# EAGLE schematic axiom_beta_power_board_v2.23.5cae2732 (EAGLE 7.7.0), part 1 of 2
Assembly variants: Beta, Min

## Sheet 1 of 17
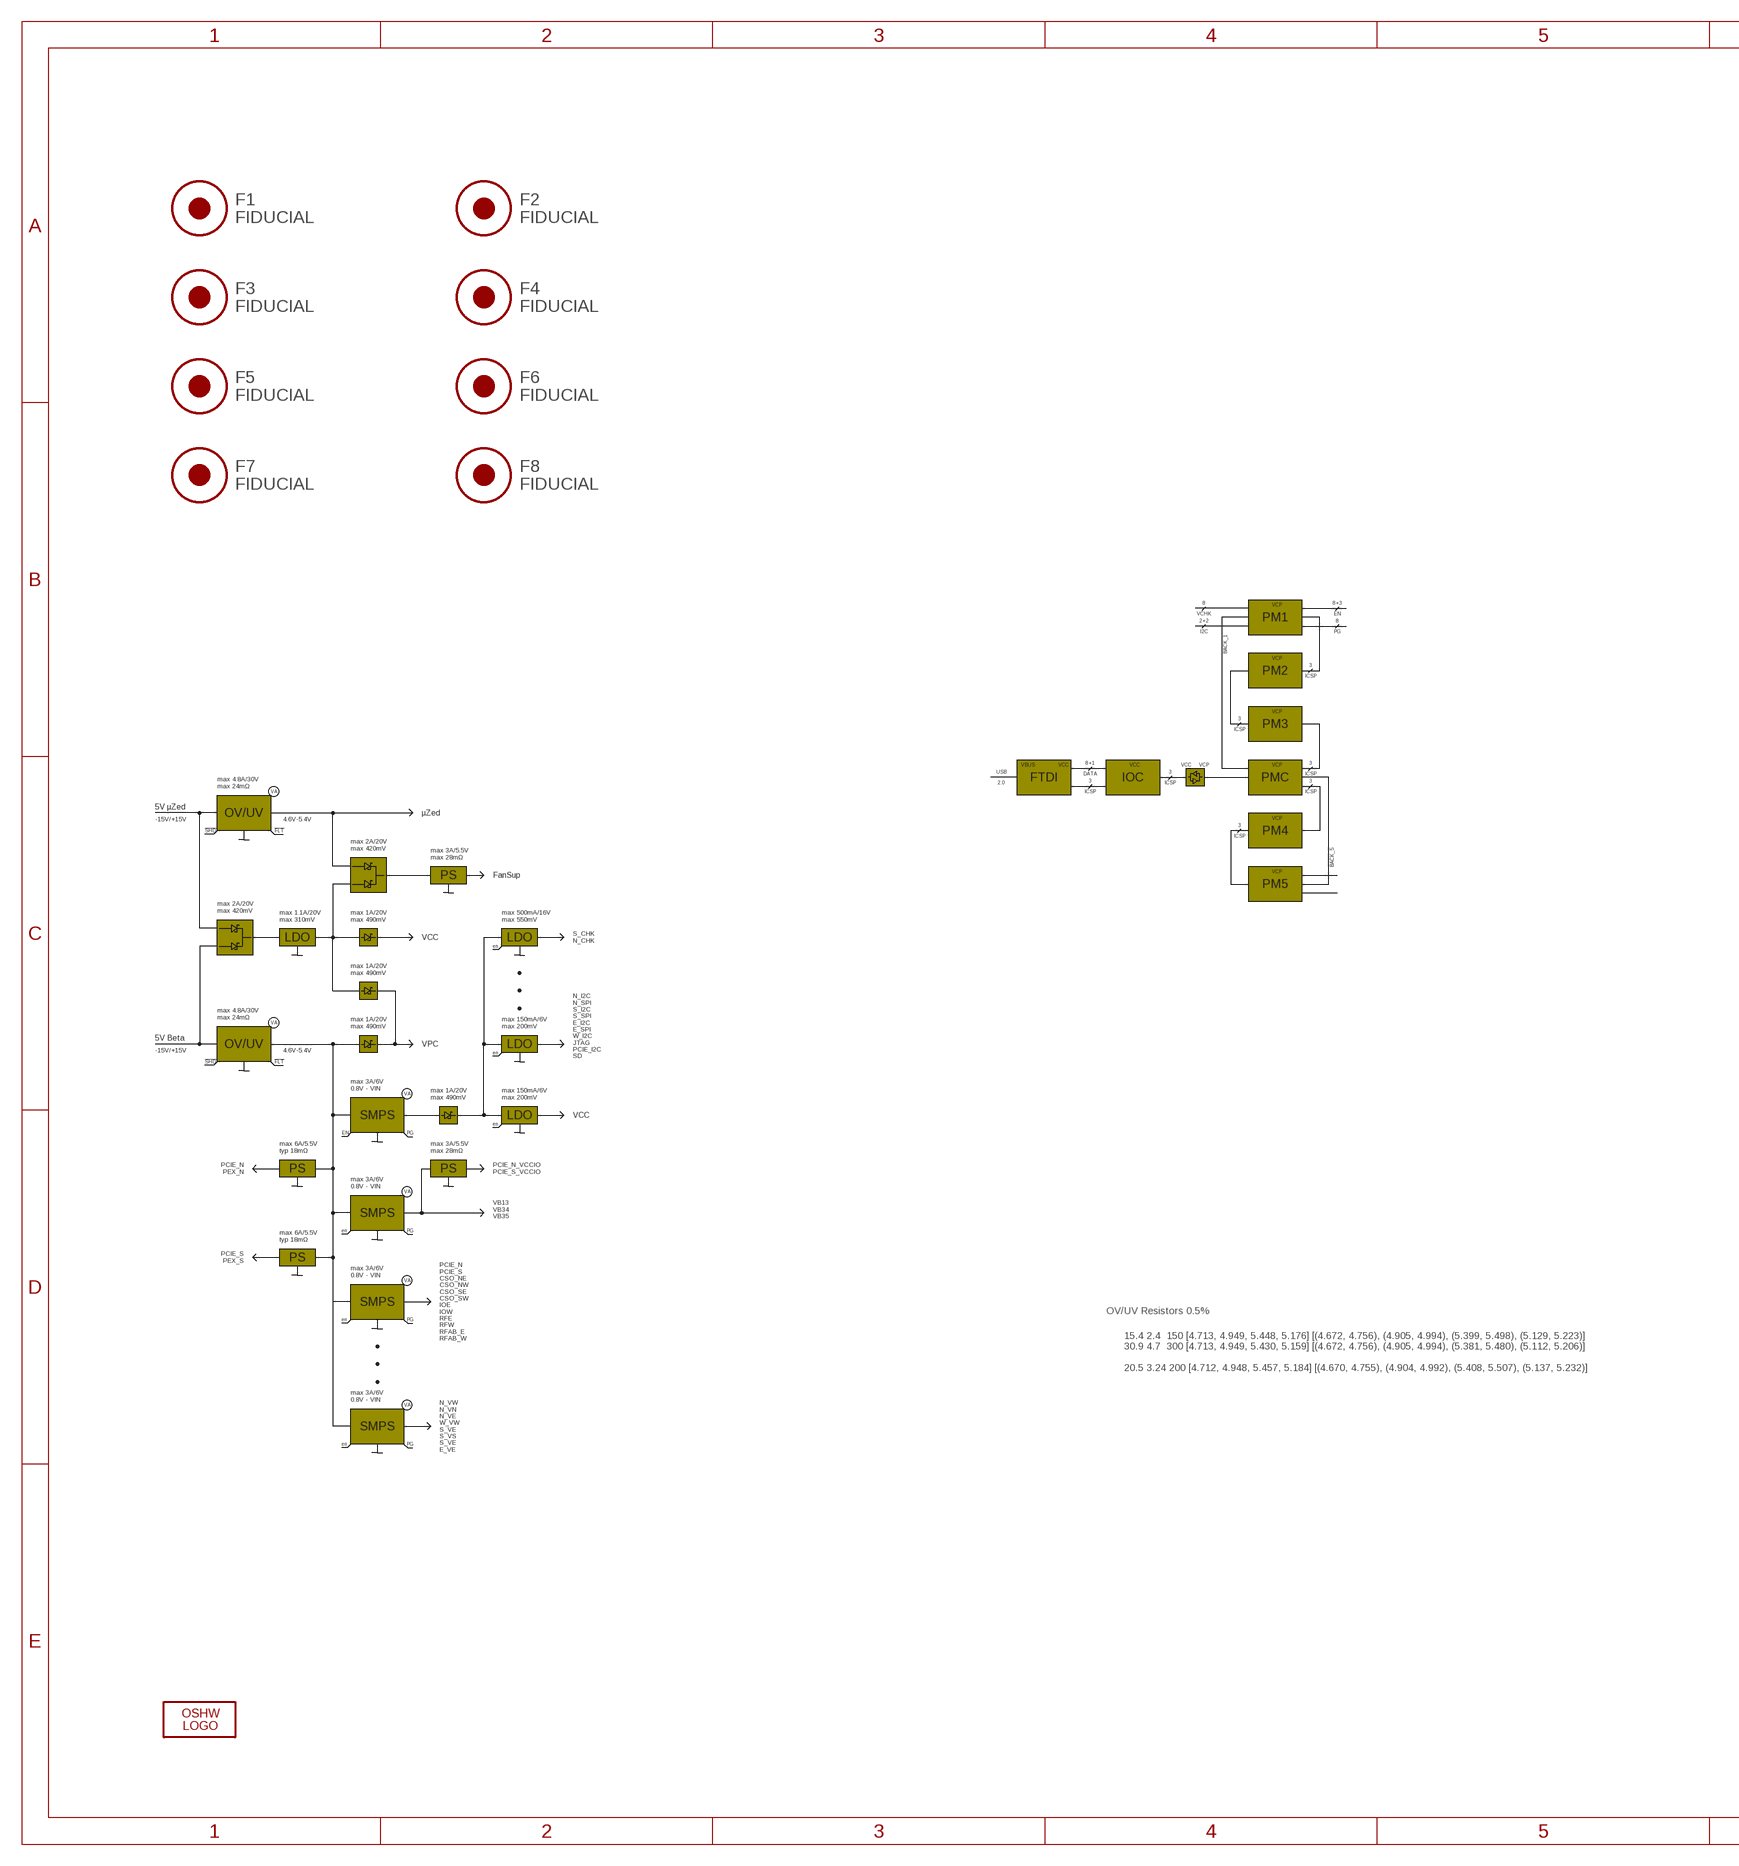
[diagram p0: schematic, sheet 1, part 1 of 2]
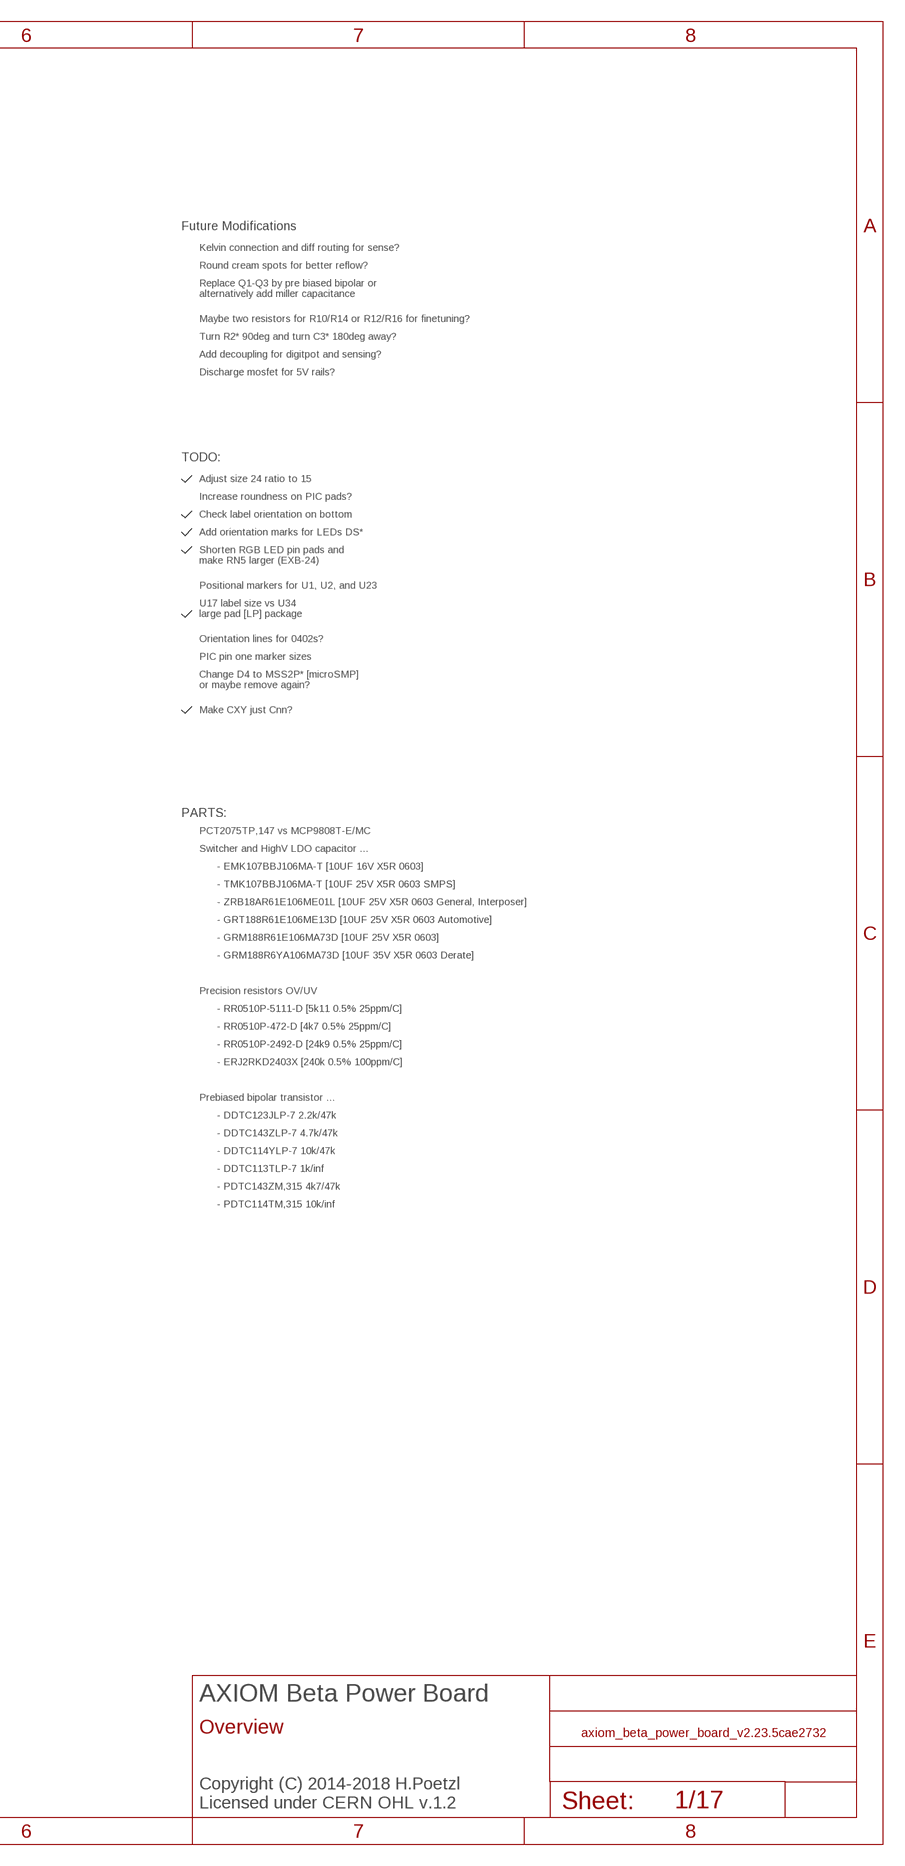
[diagram p1: schematic, sheet 1, part 2 of 2]

### Parts
F1  FIDUCIAL  [FID_ARROW]
F2  FIDUCIAL  [FID_ARROW]
F3  FIDUCIAL  [FID_ARROW]
F4  FIDUCIAL  [FID_ARROW]
F5  FIDUCIAL  [FID_ARROW]
F6  FIDUCIAL  [FID_ARROW]
F7  FIDUCIAL  [FID_ARROW]
F8  FIDUCIAL  [FID_ARROW]
LOGO1  OSHW_LOGO_FILLX0100-NT  [OSHW_FILLX100_NOTEXT]

### Notes on the sheet
- Future Modifications
- Kelvin connection and diff routing for sense?
- Round cream spots for better reflow?
- Replace Q1-Q3 by pre biased bipolar or
  alternatively add miller capacitance
- Maybe two resistors for R10/R14 or R12/R16 for finetuning?
- Turn R2* 90deg and turn C3* 180deg away?
- Add decoupling for digitpot and sensing?
- Discharge mosfet for 5V rails?
- TODO:
- Adjust size 24 ratio to 15
- Increase roundness on PIC pads?
- Check label orientation on bottom
- Add orientation marks for LEDs DS*
- Shorten RGB LED pin pads and
  make RN5 larger (EXB-24)
- Positional markers for U1, U2, and U23
- U17 label size vs U34
  large pad [LP] package
- 8 | 8+3
- VCP
- VCHK | EN
- PM1
- 2+2 | 8
- I2C | PG
- Orientation lines for 0402s?
- BACK_1
- PIC pin one marker sizes
- VCP
- 3
- PM2
- Change D4 to MSS2P* [microSMP]
  or maybe remove again?
- ICSP
- Make CXY just Cnn?
- VCP
- 3
- PM3
- ICSP
- 8+1 | 3
- VBUS | VCC | VCC | VCC | VCP | VCP
- USB | 3
- DATA | ICSP
- max 4.8A/30V
  max 24mΩ
- FTDI | IOC | PMC
- 3 | 3
- 2.0 | ICSP
- VA | ICSP | ICSP
- 5V µZed
- OV/UV | µZed | PARTS:
- VCP
- -15V/+15V | 4.6V-5.4V
- 3
- !SHD | !FLT | PM4 | PCT2075TP,147 vs MCP9808T-E/MC
- ICSP
- max 2A/20V
  max 420mV
- max 3A/5.5V
  max 28mΩ
- Switcher and HighV LDO capacitor ...
- BACK_5
- - EMK107BBJ106MA-T [10UF 16V X5R 0603]
- VCP
- PS | FanSup
- PM5 | - TMK107BBJ106MA-T [10UF 25V X5R 0603 SMPS]
- max 2A/20V
  max 420mV
- - ZRB18AR61E106ME01L [10UF 25V X5R 0603 General, Interposer]
- max 1.1A/20V
  max 310mV
- max 1A/20V
  max 490mV
- max 500mA/16V
  max 550mV
- - GRT188R61E106ME13D [10UF 25V X5R 0603 Automotive]
- LDO | VCC | LDO
- S_CHK
  N_CHK
- - GRM188R61E106MA73D [10UF 25V X5R 0603]
- en
- - GRM188R6YA106MA73D [10UF 35V X5R 0603 Derate]
- max 1A/20V
  max 490mV
- Precision resistors OV/UV
- max 4.8A/30V
  max 24mΩ
- - RR0510P-5111-D [5k11 0.5% 25ppm/C]
- max 1A/20V
  max 490mV
- max 150mA/6V
  max 200mV
- VA
- N_I2C
  N_SPI
  S_I2C
  S_SPI
  E_I2C
  E_SPI
  W_I2C
  JTAG
  PCIE_I2C
  SD
- - RR0510P-472-D [4k7 0.5% 25ppm/C]
- 5V Beta
- OV/UV | VPC | LDO | - RR0510P-2492-D [24k9 0.5% 25ppm/C]
- -15V/+15V | 4.6V-5.4V | en
- !SHD | !FLT | - ERJ2RKD2403X [240k 0.5% 100ppm/C]
- max 3A/6V
  0.8V - VIN
- max 1A/20V
  max 490mV
- max 150mA/6V
  max 200mV
- VA
- Prebiased bipolar transistor ...
- SMPS | LDO | VCC | - DDTC123JLP-7 2.2k/47k
- en
- EN | PG | - DDTC143ZLP-7 4.7k/47k
- max 6A/5.5V
  typ 18mΩ
- max 3A/5.5V
  max 28mΩ
- - DDTC114YLP-7 10k/47k
- PCIE_N
  PEX_N
- PS | PS
- PCIE_N_VCCIO
  PCIE_S_VCCIO
- - DDTC113TLP-7 1k/inf
- max 3A/6V
  0.8V - VIN
- - PDTC143ZM,315 4k7/47k
- VA
- - PDTC114TM,315 10k/inf
- SMPS
- VB13
  VB34
  VB35
- max 6A/5.5V
  typ 18mΩ
- en | PG
- PCIE_S
  PEX_S
- PS
- max 3A/6V
  0.8V - VIN
- VA
- SMPS
- PCIE_N
  PCIE_S
  CSO_NE
  CSO_NW
  CSO_SE
  CSO_SW
  IOE
  IOW
  RFE
  RFW
  RFAB_E
  RFAB_W
- OV/UV Resistors 0.5%
- en | PG
- 15.4 2.4  150 [4.713, 4.949, 5.448, 5.176] [(4.672, 4.756), (4.905, 4.994), (5.399, 5.498), (5.129, 5.223)]
  30.9 4.7  300 [4.713, 4.949, 5.430, 5.159] [(4.672, 4.756), (4.905, 4.994), (5.381, 5.480), (5.112, 5.206)]
  
  20.5 3.24 200 [4.712, 4.948, 5.457, 5.184] [(4.670, 4.755), (4.904, 4.992), (5.408, 5.507), (5.137, 5.232)]
- max 3A/6V
  0.8V - VIN
- VA
- SMPS
- N_VW
  N_VN
  N_VE
  W_VW
  S_VE
  S_VS
  S_VE
  E_VE
- en | PG
- AXIOM Beta Power Board
- Overview
- Copyright (C) 2014-2018 H.Poetzl
  Licensed under CERN OHL v.1.2

## Sheet 2 of 17
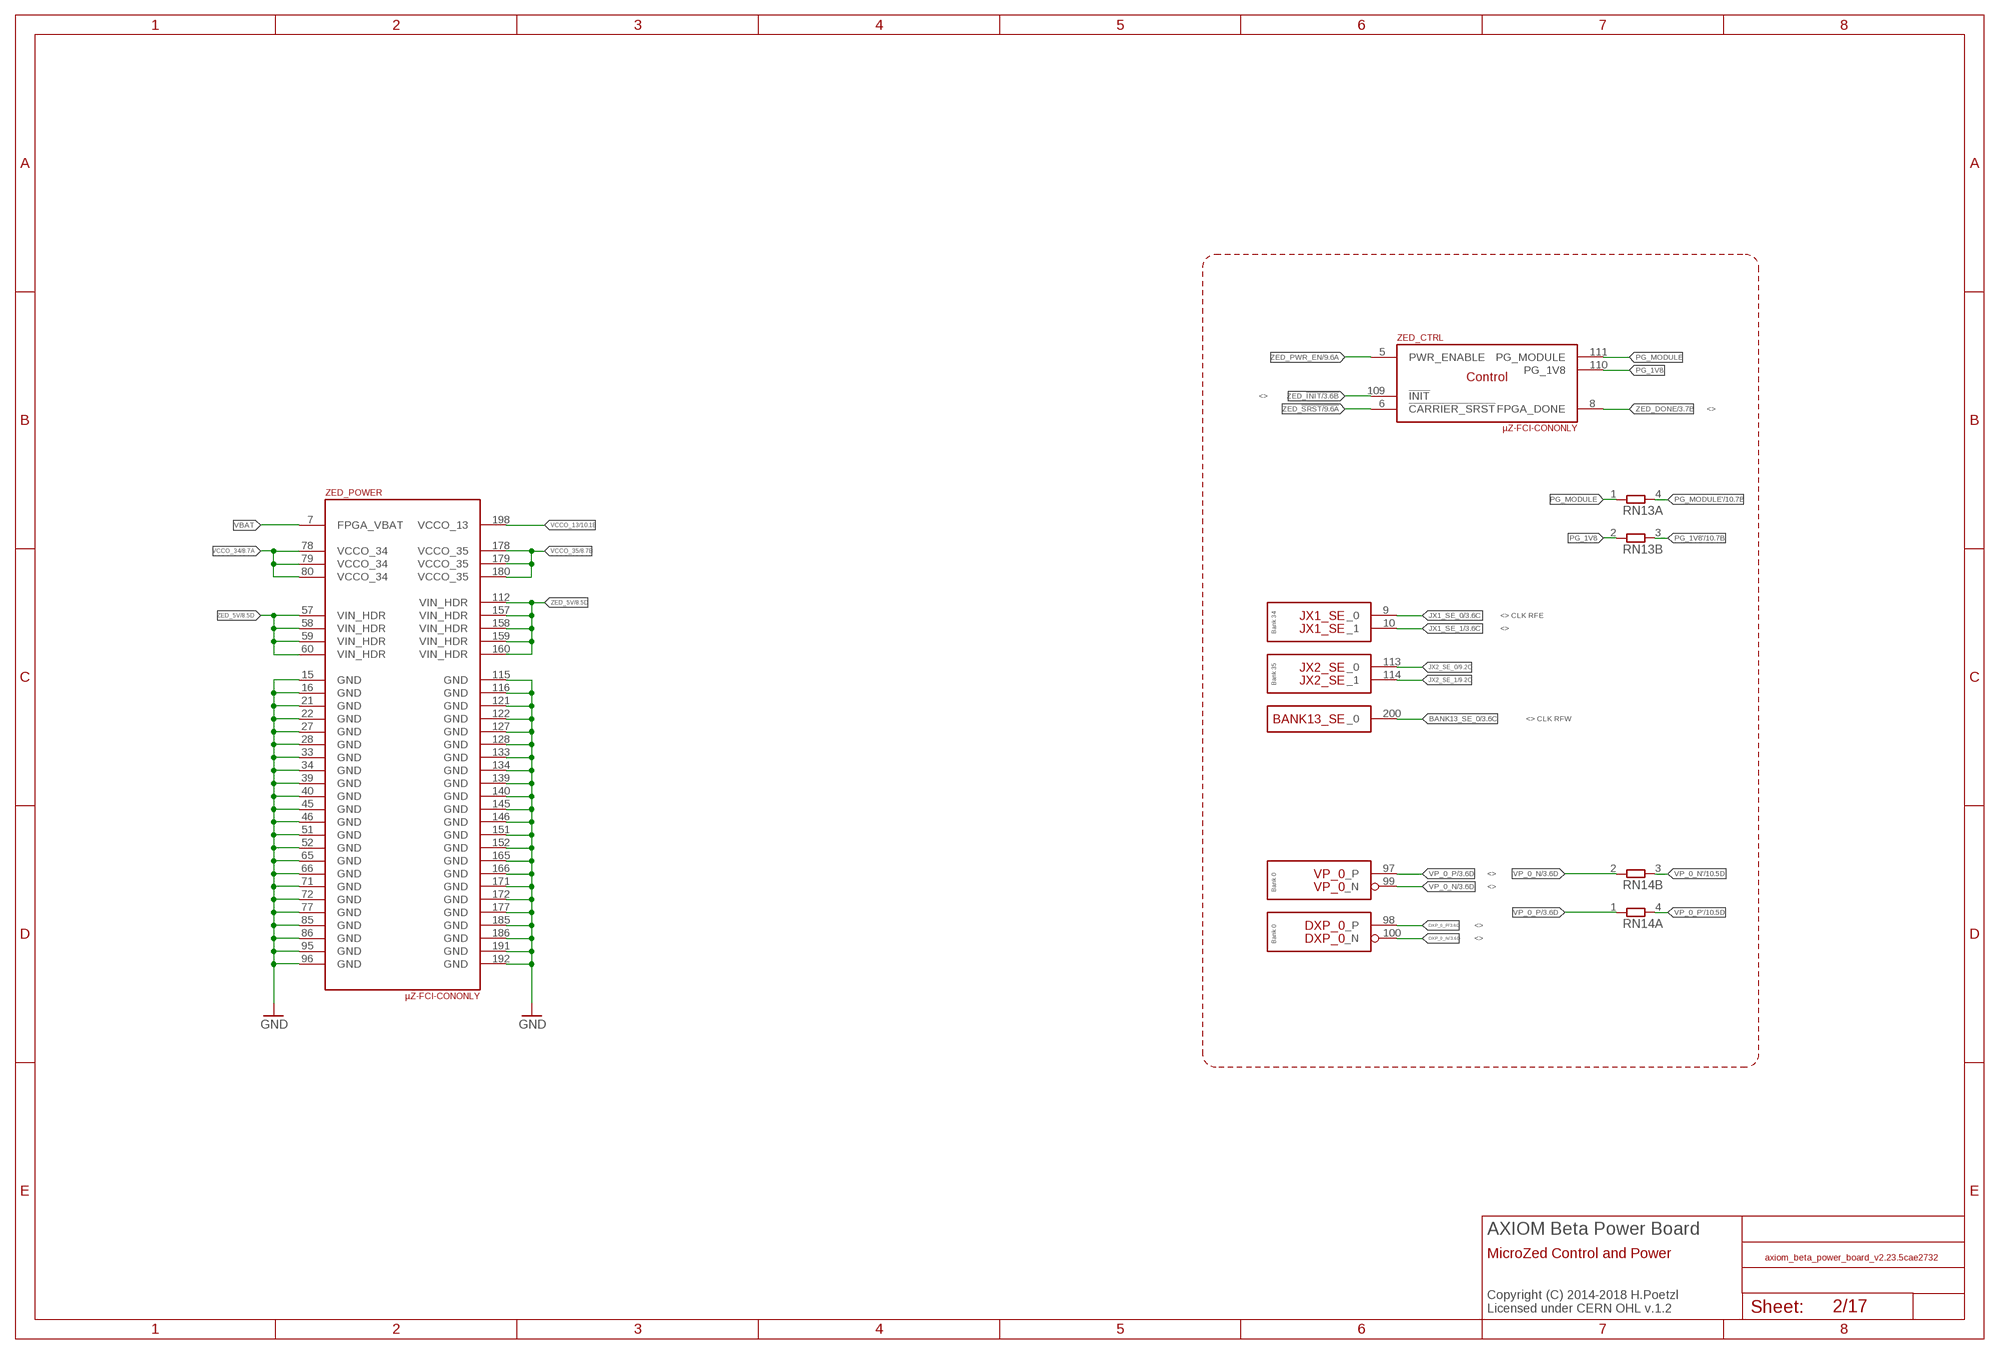
[diagram p2: schematic, sheet 2]

### Parts
RN13  2R-NEXB24V  [EXB24V]
RN14  2R-NEXB24V  [EXB24V]
ZED  µZ-FCI-CONONLY  [µZ-CONONLY]

### Nets
BANK13_SE_0: ZED.200(BANK13_SE:_0) ; also sheet 3
DXP_0_N: ZED.100(DXP_0:_N) ; also sheet 3
DXP_0_P: ZED.98(DXP_0:_P) ; also sheet 3
GND: ZED.15(_POWER:GND) ZED.16(_POWER:GND) ZED.21(_POWER:GND) ZED.22(_POWER:GND) ZED.27(_POWER:GND) ZED.28(_POWER:GND) ZED.33(_POWER:GND) ZED.34(_POWER:GND) ZED.39(_POWER:GND) ZED.40(_POWER:GND) ZED.45(_POWER:GND) ZED.46(_POWER:GND) ZED.51(_POWER:GND) ZED.52(_POWER:GND) ZED.65(_POWER:GND) ZED.66(_POWER:GND) ZED.71(_POWER:GND) ZED.72(_POWER:GND) ZED.77(_POWER:GND) ZED.85(_POWER:GND) ZED.86(_POWER:GND) ZED.95(_POWER:GND) ZED.96(_POWER:GND) ZED.115(_POWER:GND) ZED.116(_POWER:GND) ZED.121(_POWER:GND) ZED.122(_POWER:GND) ZED.127(_POWER:GND) ZED.128(_POWER:GND) ZED.133(_POWER:GND) ZED.134(_POWER:GND) ZED.139(_POWER:GND) ZED.140(_POWER:GND) ZED.145(_POWER:GND) ZED.146(_POWER:GND) ZED.151(_POWER:GND) ZED.152(_POWER:GND) ZED.165(_POWER:GND) ZED.166(_POWER:GND) ZED.171(_POWER:GND) ZED.172(_POWER:GND) ZED.177(_POWER:GND) ZED.185(_POWER:GND) ZED.186(_POWER:GND) ZED.191(_POWER:GND) ZED.192(_POWER:GND) ; also sheet 3,5,6,7,8,9,10,11,12,13,14,15,16,17
JX1_SE_0: ZED.9(JX1_SE:_0) ; also sheet 3
JX1_SE_1: ZED.10(JX1_SE:_1) ; also sheet 3,9
JX2_SE_0: ZED.113(JX2_SE:_0) ; also sheet 9
JX2_SE_1: ZED.114(JX2_SE:_1) ; also sheet 9
PG_1V8: RN13.2 ZED.110(_CTRL:PG_1V8)
PG_1V8': RN13.3 ; also sheet 10
PG_MODULE: RN13.1 ZED.111(_CTRL:PG_MODULE)
PG_MODULE': RN13.4 ; also sheet 10
VBAT: ZED.7(_POWER:FPGA_VBAT)
VCCO_13 [LVDS]: ZED.198(_POWER:VCCO_13) ; also sheet 10,16
VCCO_34: ZED.78(_POWER:VCCO_34) ZED.79(_POWER:VCCO_34) ZED.80(_POWER:VCCO_34) ; also sheet 8,9,10,17
VCCO_35: ZED.178(_POWER:VCCO_35) ZED.179(_POWER:VCCO_35) ZED.180(_POWER:VCCO_35) ; also sheet 8,9,10,16
VP_0_N: RN14.2 ZED.99(VP_0:_N) ; also sheet 3
VP_0_N': RN14.3 ; also sheet 10
VP_0_P: RN14.1 ZED.97(VP_0:_P) ; also sheet 3
VP_0_P': RN14.4 ; also sheet 10
ZED_5V: ZED.57(_POWER:VIN_HDR) ZED.58(_POWER:VIN_HDR) ZED.59(_POWER:VIN_HDR) ZED.60(_POWER:VIN_HDR) ZED.112(_POWER:VIN_HDR) ZED.157(_POWER:VIN_HDR) ZED.158(_POWER:VIN_HDR) ZED.159(_POWER:VIN_HDR) ZED.160(_POWER:VIN_HDR) ; also sheet 8,9
ZED_!INIT: ZED.109(_CTRL:!INIT) ; also sheet 3
ZED_!SRST: ZED.6(_CTRL:!CARRIER_SRST) ; also sheet 9
ZED_DONE: ZED.8(_CTRL:FPGA_DONE) ; also sheet 3,9
ZED_PWR_EN: ZED.5(_CTRL:PWR_ENABLE) ; also sheet 9

### Notes on the sheet
- <>
- <>
- <> CLK RFE
- <>
- Bank 34
- Bank 35
- <> CLK RFW
- <>
- <>
- Bank 0
- <>
- <>
- Bank 0
- AXIOM Beta Power Board
- MicroZed Control and Power
- Copyright (C) 2014-2018 H.Poetzl
  Licensed under CERN OHL v.1.2

## Sheet 3 of 17
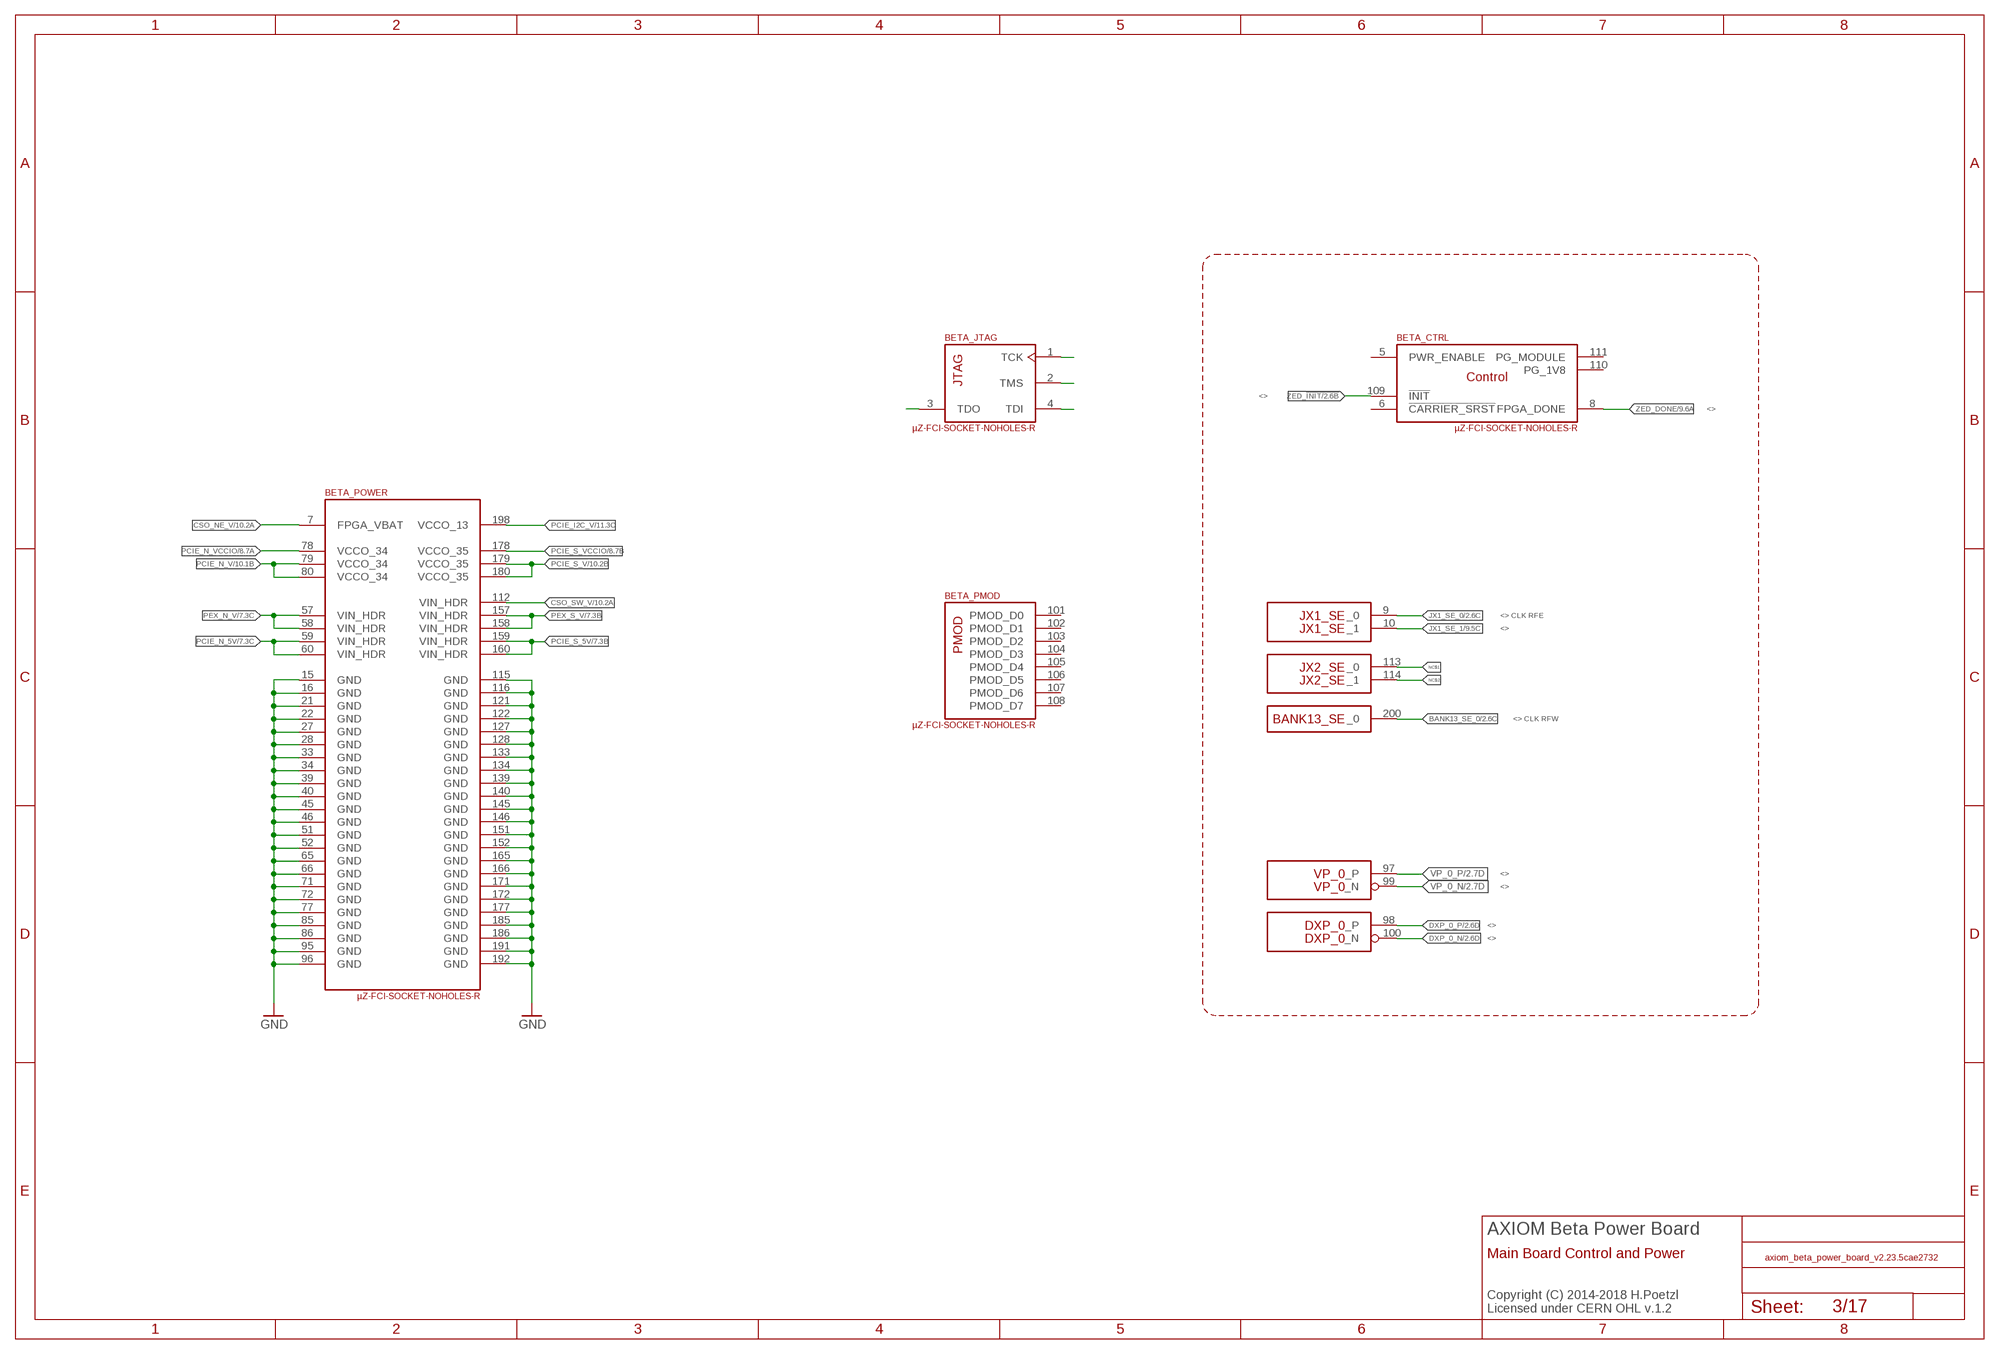
[diagram p3: schematic, sheet 3]

### Parts
BETA  µZ-FCI-SOCKET-NOHOLES-R  [µZ-SOCKET-NOHOLES-R]

### Nets
BANK13_SE_0: BETA.200(BANK13_SE:_0) ; also sheet 2
CSO_NE_V: BETA.7(_POWER:FPGA_VBAT) ; also sheet 10,17
CSO_SW_V: BETA.112(_POWER:VIN_HDR) ; also sheet 10,16
DXP_0_N: BETA.100(DXP_0:_N) ; also sheet 2
DXP_0_P: BETA.98(DXP_0:_P) ; also sheet 2
GND: BETA.15(_POWER:GND) BETA.16(_POWER:GND) BETA.21(_POWER:GND) BETA.22(_POWER:GND) BETA.27(_POWER:GND) BETA.28(_POWER:GND) BETA.33(_POWER:GND) BETA.34(_POWER:GND) BETA.39(_POWER:GND) BETA.40(_POWER:GND) BETA.45(_POWER:GND) BETA.46(_POWER:GND) BETA.51(_POWER:GND) BETA.52(_POWER:GND) BETA.65(_POWER:GND) BETA.66(_POWER:GND) BETA.71(_POWER:GND) BETA.72(_POWER:GND) BETA.77(_POWER:GND) BETA.85(_POWER:GND) BETA.86(_POWER:GND) BETA.95(_POWER:GND) BETA.96(_POWER:GND) BETA.115(_POWER:GND) BETA.116(_POWER:GND) BETA.121(_POWER:GND) BETA.122(_POWER:GND) BETA.127(_POWER:GND) BETA.128(_POWER:GND) BETA.133(_POWER:GND) BETA.134(_POWER:GND) BETA.139(_POWER:GND) BETA.140(_POWER:GND) BETA.145(_POWER:GND) BETA.146(_POWER:GND) BETA.151(_POWER:GND) BETA.152(_POWER:GND) BETA.165(_POWER:GND) BETA.166(_POWER:GND) BETA.171(_POWER:GND) BETA.172(_POWER:GND) BETA.177(_POWER:GND) BETA.185(_POWER:GND) BETA.186(_POWER:GND) BETA.191(_POWER:GND) BETA.192(_POWER:GND) ; also sheet 2,5,6,7,8,9,10,11,12,13,14,15,16,17
JX1_SE_0: BETA.9(JX1_SE:_0) ; also sheet 2
JX1_SE_1: BETA.10(JX1_SE:_1) ; also sheet 2,9
N$9: BETA.4(_JTAG:TDI)
N$10: BETA.2(_JTAG:TMS)
N$11: BETA.1(_JTAG:TCK)
N$13: BETA.3(_JTAG:TDO)
NC$1: BETA.113(JX2_SE:_0)
NC$2: BETA.114(JX2_SE:_1)
PCIE_I2C_V: BETA.198(_POWER:VCCO_13) ; also sheet 11
PCIE_N_5V: BETA.59(_POWER:VIN_HDR) BETA.60(_POWER:VIN_HDR) ; also sheet 7
PCIE_N_V: BETA.79(_POWER:VCCO_34) BETA.80(_POWER:VCCO_34) ; also sheet 10,17
PCIE_N_VCCIO: BETA.78(_POWER:VCCO_34) ; also sheet 8
PCIE_S_5V: BETA.159(_POWER:VIN_HDR) BETA.160(_POWER:VIN_HDR) ; also sheet 7
PCIE_S_V: BETA.179(_POWER:VCCO_35) BETA.180(_POWER:VCCO_35) ; also sheet 10,16
PCIE_S_VCCIO: BETA.178(_POWER:VCCO_35) ; also sheet 8
PEX_N_V: BETA.57(_POWER:VIN_HDR) BETA.58(_POWER:VIN_HDR) ; also sheet 7
PEX_S_V: BETA.157(_POWER:VIN_HDR) BETA.158(_POWER:VIN_HDR) ; also sheet 7
VP_0_N: BETA.99(VP_0:_N) ; also sheet 2
VP_0_P: BETA.97(VP_0:_P) ; also sheet 2
ZED_!INIT: BETA.109(_CTRL:!INIT) ; also sheet 2
ZED_DONE: BETA.8(_CTRL:FPGA_DONE) ; also sheet 2,9
Unconnected: BETA.5(_CTRL:PWR_ENABLE) BETA.6(_CTRL:!CARRIER_SRST) BETA.101(_PMOD:PMOD_D0) BETA.102(_PMOD:PMOD_D1) BETA.103(_PMOD:PMOD_D2) BETA.104(_PMOD:PMOD_D3) BETA.105(_PMOD:PMOD_D4) BETA.106(_PMOD:PMOD_D5) BETA.107(_PMOD:PMOD_D6) BETA.108(_PMOD:PMOD_D7) BETA.110(_CTRL:PG_1V8) BETA.111(_CTRL:PG_MODULE)

### Notes on the sheet
- <>
- <>
- <> CLK RFE
- <>
- <> CLK RFW
- <>
- <>
- <>
- <>
- AXIOM Beta Power Board
- Main Board Control and Power
- Copyright (C) 2014-2018 H.Poetzl
  Licensed under CERN OHL v.1.2

## Sheet 4 of 17
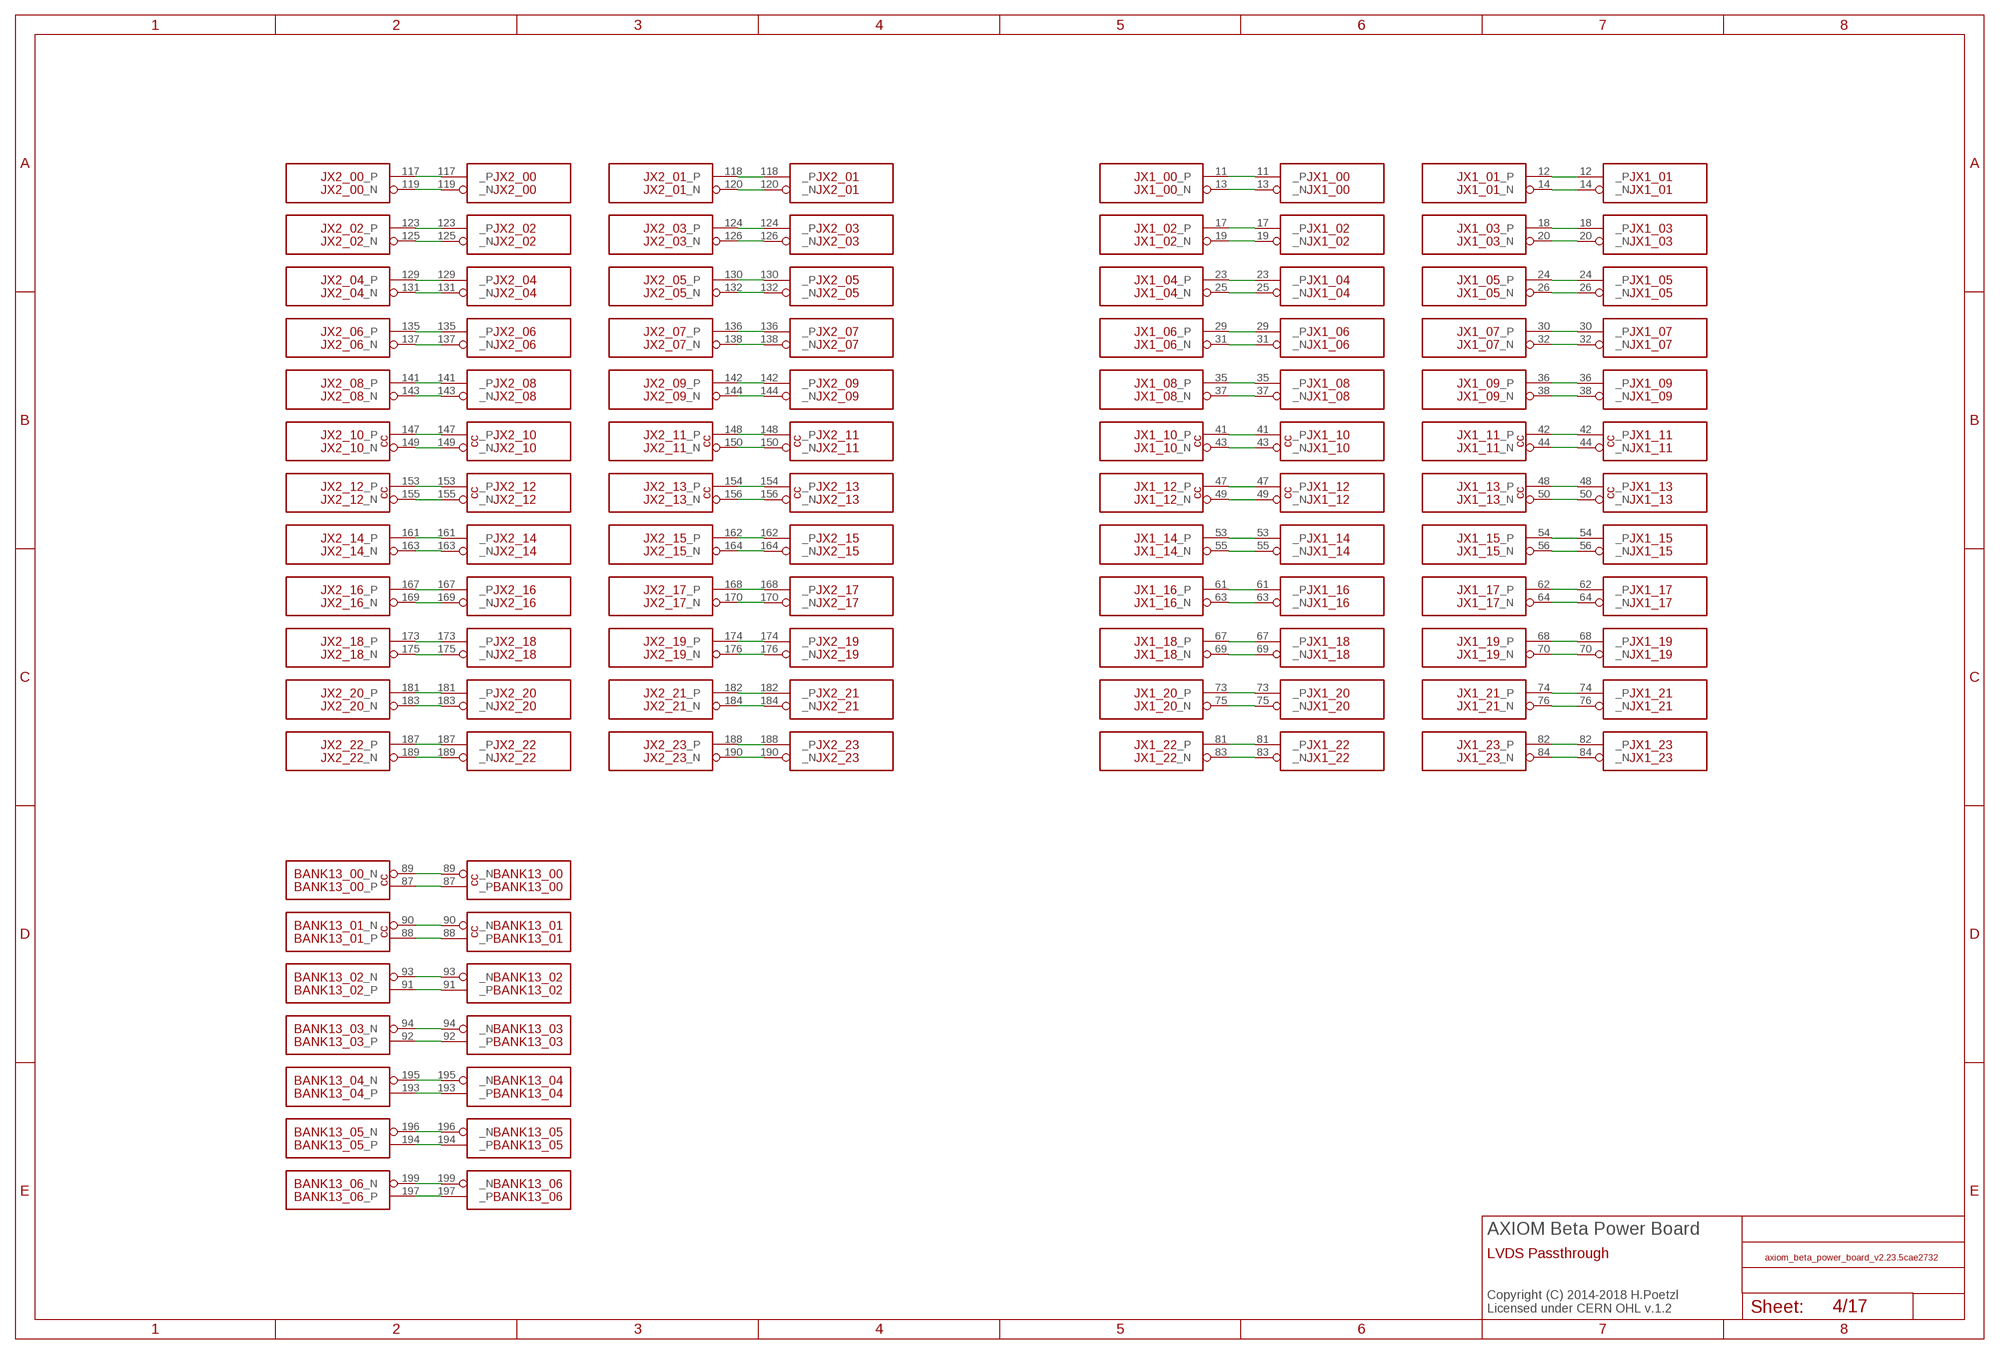
[diagram p4: schematic, sheet 4]

### Nets
BANK13_00_N [LVDS]: BETA.89(BANK13_00:_N) ZED.89(BANK13_00:_N)
BANK13_00_P [LVDS]: BETA.87(BANK13_00:_P) ZED.87(BANK13_00:_P)
BANK13_01_N [LVDS]: BETA.90(BANK13_01:_N) ZED.90(BANK13_01:_N)
BANK13_01_P [LVDS]: BETA.88(BANK13_01:_P) ZED.88(BANK13_01:_P)
BANK13_02_N [LVDS]: BETA.93(BANK13_02:_N) ZED.93(BANK13_02:_N)
BANK13_02_P [LVDS]: BETA.91(BANK13_02:_P) ZED.91(BANK13_02:_P)
BANK13_03_N [LVDS]: BETA.94(BANK13_03:_N) ZED.94(BANK13_03:_N)
BANK13_03_P [LVDS]: BETA.92(BANK13_03:_P) ZED.92(BANK13_03:_P)
BANK13_04_N [LVDS]: BETA.195(BANK13_04:_N) ZED.195(BANK13_04:_N)
BANK13_04_P [LVDS]: BETA.193(BANK13_04:_P) ZED.193(BANK13_04:_P)
BANK13_05_N: BETA.196(BANK13_05:_N) ZED.196(BANK13_05:_N)
BANK13_05_P: BETA.194(BANK13_05:_P) ZED.194(BANK13_05:_P)
BANK13_06_N [LVDS]: BETA.199(BANK13_06:_N) ZED.199(BANK13_06:_N)
BANK13_06_P [LVDS]: BETA.197(BANK13_06:_P) ZED.197(BANK13_06:_P)
JX1_00_N [LVDS]: BETA.13(JX1_00:_N) ZED.13(JX1_00:_N)
JX1_00_P [LVDS]: BETA.11(JX1_00:_P) ZED.11(JX1_00:_P)
JX1_01_N [LVDS]: BETA.14(JX1_01:_N) ZED.14(JX1_01:_N)
JX1_01_P [LVDS]: BETA.12(JX1_01:_P) ZED.12(JX1_01:_P)
JX1_02_N [LVDS]: BETA.19(JX1_02:_N) ZED.19(JX1_02:_N)
JX1_02_P [LVDS]: BETA.17(JX1_02:_P) ZED.17(JX1_02:_P)
JX1_03_N [LVDS]: BETA.20(JX1_03:_N) ZED.20(JX1_03:_N)
JX1_03_P [LVDS]: BETA.18(JX1_03:_P) ZED.18(JX1_03:_P)
JX1_04_N [LVDS]: BETA.25(JX1_04:_N) ZED.25(JX1_04:_N)
JX1_04_P [LVDS]: BETA.23(JX1_04:_P) ZED.23(JX1_04:_P)
JX1_05_N: BETA.26(JX1_05:_N) ZED.26(JX1_05:_N)
JX1_05_P: BETA.24(JX1_05:_P) ZED.24(JX1_05:_P)
JX1_06_N [LVDS]: BETA.31(JX1_06:_N) ZED.31(JX1_06:_N)
JX1_06_P [LVDS]: BETA.29(JX1_06:_P) ZED.29(JX1_06:_P)
JX1_07_N [LVDS]: BETA.32(JX1_07:_N) ZED.32(JX1_07:_N)
JX1_07_P [LVDS]: BETA.30(JX1_07:_P) ZED.30(JX1_07:_P)
JX1_08_N: BETA.37(JX1_08:_N) ZED.37(JX1_08:_N)
JX1_08_P: BETA.35(JX1_08:_P) ZED.35(JX1_08:_P)
JX1_09_N [LVDS]: BETA.38(JX1_09:_N) ZED.38(JX1_09:_N)
JX1_09_P [LVDS]: BETA.36(JX1_09:_P) ZED.36(JX1_09:_P)
JX1_10_N [LVDS]: BETA.43(JX1_10:_N) ZED.43(JX1_10:_N)
JX1_10_P [LVDS]: BETA.41(JX1_10:_P) ZED.41(JX1_10:_P)
JX1_11_N [LVDS]: BETA.44(JX1_11:_N) ZED.44(JX1_11:_N)
JX1_11_P [LVDS]: BETA.42(JX1_11:_P) ZED.42(JX1_11:_P)
JX1_12_N [LVDS]: BETA.49(JX1_12:_N) ZED.49(JX1_12:_N)
JX1_12_P [LVDS]: BETA.47(JX1_12:_P) ZED.47(JX1_12:_P)
JX1_13_N [LVDS]: BETA.50(JX1_13:_N) ZED.50(JX1_13:_N)
JX1_13_P [LVDS]: BETA.48(JX1_13:_P) ZED.48(JX1_13:_P)
JX1_14_N [LVDS]: BETA.55(JX1_14:_N) ZED.55(JX1_14:_N)
JX1_14_P [LVDS]: BETA.53(JX1_14:_P) ZED.53(JX1_14:_P)
JX1_15_N: BETA.56(JX1_15:_N) ZED.56(JX1_15:_N)
JX1_15_P: BETA.54(JX1_15:_P) ZED.54(JX1_15:_P)
JX1_16_N [LVDS]: BETA.63(JX1_16:_N) ZED.63(JX1_16:_N)
JX1_16_P [LVDS]: BETA.61(JX1_16:_P) ZED.61(JX1_16:_P)
JX1_17_N [LVDS]: BETA.64(JX1_17:_N) ZED.64(JX1_17:_N)
JX1_17_P [LVDS]: BETA.62(JX1_17:_P) ZED.62(JX1_17:_P)
JX1_18_N [LVDS]: BETA.69(JX1_18:_N) ZED.69(JX1_18:_N)
JX1_18_P [LVDS]: BETA.67(JX1_18:_P) ZED.67(JX1_18:_P)
JX1_19_N [LVDS]: BETA.70(JX1_19:_N) ZED.70(JX1_19:_N)
JX1_19_P [LVDS]: BETA.68(JX1_19:_P) ZED.68(JX1_19:_P)
JX1_20_N: BETA.75(JX1_20:_N) ZED.75(JX1_20:_N)
JX1_20_P: BETA.73(JX1_20:_P) ZED.73(JX1_20:_P)
JX1_21_N: BETA.76(JX1_21:_N) ZED.76(JX1_21:_N)
JX1_21_P: BETA.74(JX1_21:_P) ZED.74(JX1_21:_P)
JX1_22_N: BETA.83(JX1_22:_N) ZED.83(JX1_22:_N)
JX1_22_P: BETA.81(JX1_22:_P) ZED.81(JX1_22:_P)
JX1_23_N [LVDS]: BETA.84(JX1_23:_N) ZED.84(JX1_23:_N)
JX1_23_P [LVDS]: BETA.82(JX1_23:_P) ZED.82(JX1_23:_P)
JX2_00_N [LVDS]: BETA.119(JX2_00:_N) ZED.119(JX2_00:_N)
JX2_00_P [LVDS]: BETA.117(JX2_00:_P) ZED.117(JX2_00:_P)
JX2_01_N [LVDS]: BETA.120(JX2_01:_N) ZED.120(JX2_01:_N)
JX2_01_P [LVDS]: BETA.118(JX2_01:_P) ZED.118(JX2_01:_P)
JX2_02_N [LVDS]: BETA.125(JX2_02:_N) ZED.125(JX2_02:_N)
JX2_02_P [LVDS]: BETA.123(JX2_02:_P) ZED.123(JX2_02:_P)
JX2_03_N [LVDS]: BETA.126(JX2_03:_N) ZED.126(JX2_03:_N)
JX2_03_P [LVDS]: BETA.124(JX2_03:_P) ZED.124(JX2_03:_P)
JX2_04_N [LVDS]: BETA.131(JX2_04:_N) ZED.131(JX2_04:_N)
JX2_04_P [LVDS]: BETA.129(JX2_04:_P) ZED.129(JX2_04:_P)
JX2_05_N [LVDS]: BETA.132(JX2_05:_N) ZED.132(JX2_05:_N)
JX2_05_P [LVDS]: BETA.130(JX2_05:_P) ZED.130(JX2_05:_P)
JX2_06_N [LVDS]: BETA.137(JX2_06:_N) ZED.137(JX2_06:_N)
JX2_06_P [LVDS]: BETA.135(JX2_06:_P) ZED.135(JX2_06:_P)
JX2_07_N [LVDS]: BETA.138(JX2_07:_N) ZED.138(JX2_07:_N)
JX2_07_P [LVDS]: BETA.136(JX2_07:_P) ZED.136(JX2_07:_P)
JX2_08_N [LVDS]: BETA.143(JX2_08:_N) ZED.143(JX2_08:_N)
JX2_08_P [LVDS]: BETA.141(JX2_08:_P) ZED.141(JX2_08:_P)
JX2_09_N [LVDS]: BETA.144(JX2_09:_N) ZED.144(JX2_09:_N)
JX2_09_P [LVDS]: BETA.142(JX2_09:_P) ZED.142(JX2_09:_P)
JX2_10_N [LVDS]: BETA.149(JX2_10:_N) ZED.149(JX2_10:_N)
JX2_10_P [LVDS]: BETA.147(JX2_10:_P) ZED.147(JX2_10:_P)
JX2_11_N [LVDS]: BETA.150(JX2_11:_N) ZED.150(JX2_11:_N)
JX2_11_P [LVDS]: BETA.148(JX2_11:_P) ZED.148(JX2_11:_P)
JX2_12_N [LVDS]: BETA.155(JX2_12:_N) ZED.155(JX2_12:_N)
JX2_12_P [LVDS]: BETA.153(JX2_12:_P) ZED.153(JX2_12:_P)
JX2_13_N [LVDS]: BETA.156(JX2_13:_N) ZED.156(JX2_13:_N)
JX2_13_P [LVDS]: BETA.154(JX2_13:_P) ZED.154(JX2_13:_P)
JX2_14_N: BETA.163(JX2_14:_N) ZED.163(JX2_14:_N)
JX2_14_P: BETA.161(JX2_14:_P) ZED.161(JX2_14:_P)
JX2_15_N [LVDS]: BETA.164(JX2_15:_N) ZED.164(JX2_15:_N)
JX2_15_P [LVDS]: BETA.162(JX2_15:_P) ZED.162(JX2_15:_P)
JX2_16_N [LVDS]: BETA.169(JX2_16:_N) ZED.169(JX2_16:_N)
JX2_16_P [LVDS]: BETA.167(JX2_16:_P) ZED.167(JX2_16:_P)
JX2_17_N [LVDS]: BETA.170(JX2_17:_N) ZED.170(JX2_17:_N)
JX2_17_P [LVDS]: BETA.168(JX2_17:_P) ZED.168(JX2_17:_P)
JX2_18_N [LVDS]: BETA.175(JX2_18:_N) ZED.175(JX2_18:_N)
JX2_18_P [LVDS]: BETA.173(JX2_18:_P) ZED.173(JX2_18:_P)
JX2_19_N [LVDS]: BETA.176(JX2_19:_N) ZED.176(JX2_19:_N)
JX2_19_P [LVDS]: BETA.174(JX2_19:_P) ZED.174(JX2_19:_P)
JX2_20_N [LVDS]: BETA.183(JX2_20:_N) ZED.183(JX2_20:_N)
JX2_20_P [LVDS]: BETA.181(JX2_20:_P) ZED.181(JX2_20:_P)
JX2_21_N [LVDS]: BETA.184(JX2_21:_N) ZED.184(JX2_21:_N)
JX2_21_P [LVDS]: BETA.182(JX2_21:_P) ZED.182(JX2_21:_P)
JX2_22_N: BETA.189(JX2_22:_N) ZED.189(JX2_22:_N)
JX2_22_P: BETA.187(JX2_22:_P) ZED.187(JX2_22:_P)
JX2_23_N [LVDS]: BETA.190(JX2_23:_N) ZED.190(JX2_23:_N)
JX2_23_P [LVDS]: BETA.188(JX2_23:_P) ZED.188(JX2_23:_P)

### Notes on the sheet
- AXIOM Beta Power Board
- LVDS Passthrough
- Copyright (C) 2014-2018 H.Poetzl
  Licensed under CERN OHL v.1.2

## Sheet 5 of 17
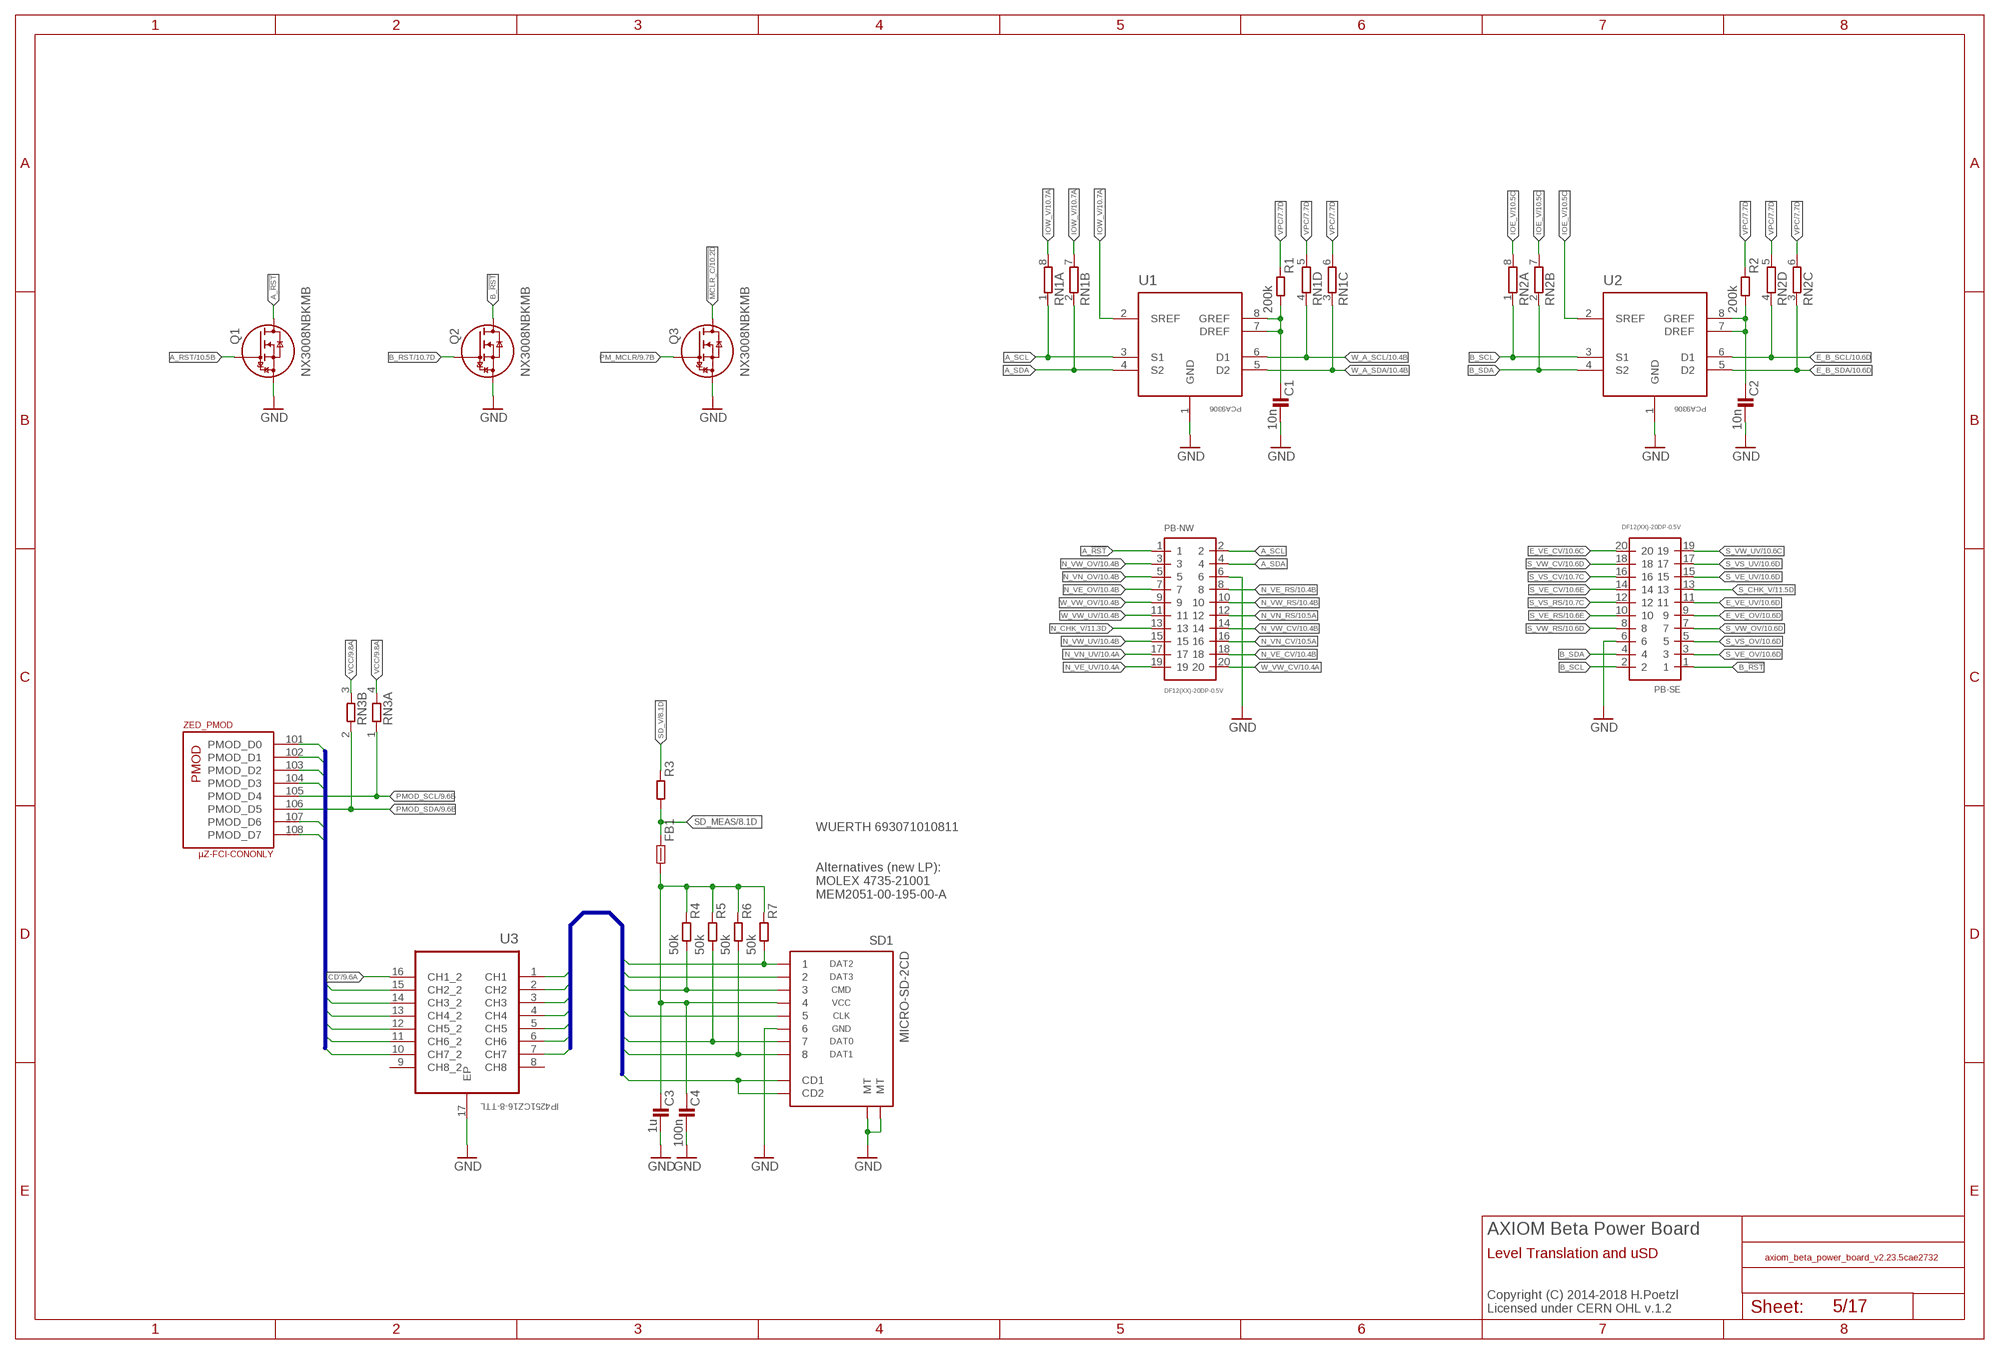
[diagram p5: schematic, sheet 5]

### Parts
C1  10n  C0402-C  [0402-C]
C2  10n  C0402-C  [0402-C]
C3  1u  C0402-C  [0402-C]
C4  100n  C0402-C  [0402-C]
FB1  FB0402-C  [0402-C]
PB-NW  DF12(XX)-20DP-0.5V  [DF12(XX)-20DP-0.5V]
PB-SE  DF12(XX)-20DP-0.5V  [DF12(XX)-20DP-0.5V]
Q1  NX3008NBKMB  [SOT883(B)]
Q2  NX3008NBKMB  [SOT883(B)]
Q3  NX3008NBKMB  [SOT883(B)]
R1  200k  R0402-C  [0402-C]
R2  200k  R0402-C  [0402-C]
R3  R0402-C  [0402-C]
R4  50k  R0402-C  [0402-C]  (not fitted in variant Min)
R5  50k  R0402-C  [0402-C]  (not fitted in variant Min)
R6  50k  R0402-C  [0402-C]  (not fitted in variant Min)
R7  50k  R0402-C  [0402-C]  (not fitted in variant Min)
RN1  4R-N0402ARV341  [4X0402ARV341]
RN2  4R-N0402ARV341  [4X0402ARV341]
RN3  2R-NEXB24V  [EXB24V]
SD1  MICRO-SD-2CD  [TF-MICRO-SD_PP2]
U1  PCA9306  [UDFN-8]
U2  PCA9306  [UDFN-8]
U3  IP4251CZ16-8-TTL  [SON40P135X330X55-17N]

### Nets
!MCLR_C: Q3.3(D) ; also sheet 10
A_!RST: PB-NW.1 Q1.3(D)
A_RST [LVDS]: Q1.1(G) ; also sheet 10
A_SCL: PB-NW.2 RN1.1 U1.3(S1)
A_SDA: PB-NW.4 RN1.2 U1.4(S2)
B_!RST: PB-SE.1 Q2.3(D)
B_RST [LVDS]: Q2.1(G) ; also sheet 10
B_SCL: PB-SE.2 RN2.1 U2.3(S1)
B_SDA: PB-SE.4 RN2.2 U2.4(S2)
CD: SD1.CD1 SD1.CD2 U3.1(CH1)
CD': U3.16(CH1_2) ; also sheet 9
CLK: SD1.5 U3.5(CH5)
CMD: R4.2 SD1.3 U3.4(CH4)
DAT0: R5.2 SD1.7 U3.6(CH6)
DAT1: R6.2 SD1.8 U3.7(CH7)
DAT2: R7.2 SD1.1 U3.2(CH2)
DAT3: SD1.2 U3.3(CH3)
E_B_SCL: RN2.4 U2.6(D1) ; also sheet 10
E_B_SDA: RN2.3 U2.5(D2) ; also sheet 10
E_VE_CV: PB-SE.20 ; also sheet 10
E_VE_OV: PB-SE.9 ; also sheet 10
E_VE_UV: PB-SE.11 ; also sheet 10
GND: C1.2 C2.2 C3.2 C4.2 PB-NW.6 PB-SE.6 Q1.2(S) Q2.2(S) Q3.2(S) SD1.6 SD1.MT1(MT) SD1.MT2(MT) U1.1(GND) U2.1(GND) U3.17(EP) ; also sheet 2,3,6,7,8,9,10,11,12,13,14,15,16,17
IOE_V: RN2.7 RN2.8 U2.2(SREF) ; also sheet 10,11,15
IOW_V: RN1.7 RN1.8 U1.2(SREF) ; also sheet 10,11,13
N$3: C3.1 C4.1 FB1.2 R4.1 R5.1 R6.1 R7.1 SD1.4
N$32: C1.1 R1.2 U1.7(DREF) U1.8(GREF)
N$33: C2.1 R2.2 U2.7(DREF) U2.8(GREF)
N_CHK_V: PB-NW.13 ; also sheet 11
N_VE_CV: PB-NW.18 ; also sheet 10
N_VE_OV: PB-NW.7 ; also sheet 10
N_VE_RS: PB-NW.8 ; also sheet 10
N_VE_UV: PB-NW.19 ; also sheet 10
N_VN_CV: PB-NW.16 ; also sheet 10
N_VN_OV: PB-NW.5 ; also sheet 10
N_VN_RS: PB-NW.12 ; also sheet 10
N_VN_UV: PB-NW.17 ; also sheet 10
N_VW_CV: PB-NW.14 ; also sheet 10
N_VW_OV: PB-NW.3 ; also sheet 10
N_VW_RS: PB-NW.10 ; also sheet 10
N_VW_UV: PB-NW.15 ; also sheet 10
PM_MCLR [LVDS]: Q3.1(G) ; also sheet 9
PMOD_D0: U3.10(CH7_2) ZED.101(_PMOD:PMOD_D0)
PMOD_D1: U3.11(CH6_2) ZED.102(_PMOD:PMOD_D1)
PMOD_D2: U3.13(CH4_2) ZED.103(_PMOD:PMOD_D2)
PMOD_D3: U3.12(CH5_2) ZED.104(_PMOD:PMOD_D3)
PMOD_D6: U3.15(CH2_2) ZED.107(_PMOD:PMOD_D6)
PMOD_D7: U3.14(CH3_2) ZED.108(_PMOD:PMOD_D7)
PMOD_SCL: RN3.1 ZED.105(_PMOD:PMOD_D4) ; also sheet 9
PMOD_SDA: RN3.2 ZED.106(_PMOD:PMOD_D5) ; also sheet 9
S_CHK_V: PB-SE.13 ; also sheet 11
S_VE_CV: PB-SE.14 ; also sheet 10
S_VE_OV: PB-SE.3 ; also sheet 10
S_VE_RS: PB-SE.10 ; also sheet 10
S_VE_UV: PB-SE.15 ; also sheet 10
S_VS_CV: PB-SE.16 ; also sheet 10
S_VS_OV: PB-SE.5 ; also sheet 10
S_VS_RS: PB-SE.12 ; also sheet 10
S_VS_UV: PB-SE.17 ; also sheet 10
S_VW_CV: PB-SE.18 ; also sheet 10
S_VW_OV: PB-SE.7 ; also sheet 10
S_VW_RS: PB-SE.8 ; also sheet 10
S_VW_UV: PB-SE.19 ; also sheet 10
SD_MEAS [LVDS]: FB1.1 R3.2 ; also sheet 8
SD_V: R3.1 ; also sheet 8,11
VCC: RN3.3 RN3.4 ; also sheet 9,11
VPC: R1.1 R2.1 RN1.5 RN1.6 RN2.5 RN2.6 ; also sheet 7,8,9,10
W_A_SCL: RN1.4 U1.6(D1) ; also sheet 10
W_A_SDA: RN1.3 U1.5(D2) ; also sheet 10
W_VW_CV: PB-NW.20 ; also sheet 10
W_VW_OV: PB-NW.9 ; also sheet 10
W_VW_UV: PB-NW.11 ; also sheet 10
Unconnected: U3.8(CH8) U3.9(CH8_2)

### Buses
PMOD_D[0..7]
CMD,CLK,DAT[0..3],CD

### Notes on the sheet
- WUERTH 693071010811
  
  
  Alternatives (new LP):
  MOLEX 4735-21001
  MEM2051-00-195-00-A
- AXIOM Beta Power Board
- Level Translation and uSD
- Copyright (C) 2014-2018 H.Poetzl
  Licensed under CERN OHL v.1.2

## Sheet 6 of 17
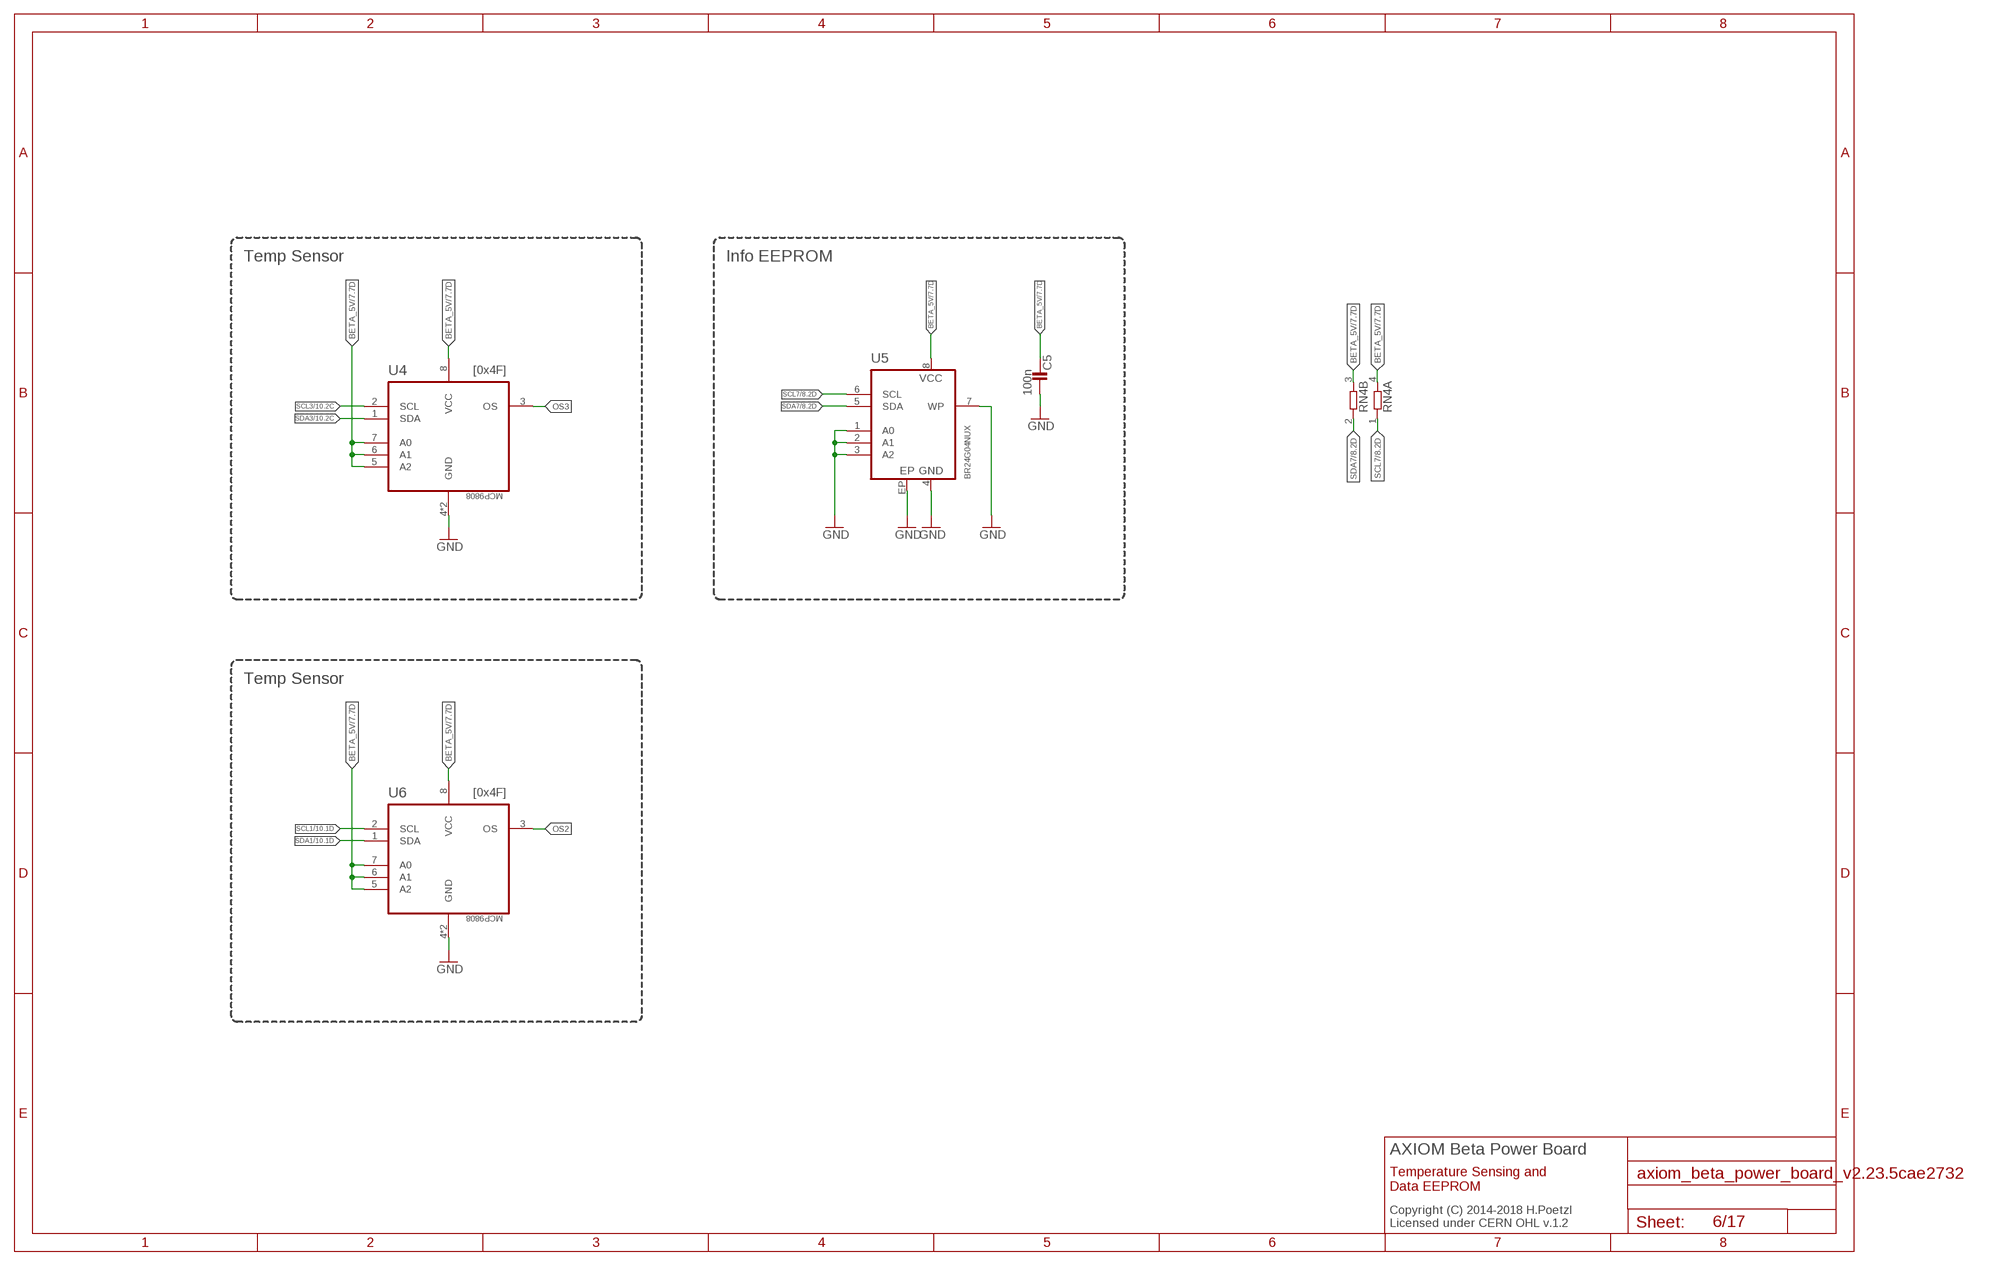
[diagram p6: schematic, sheet 6]

### Parts
C5  100n  C0402-B  [0402-B]
RN4  2R-NEXB24V  [EXB24V]
U4  MCP9808  [DFN-8]
U5  BR24G04NUX  [DFN200X300X100-9N]
U6  MCP9808  [DFN-8]

### Nets
BETA_5V: C5.1 RN4.3 RN4.4 U4.5(A2) U4.6(A1) U4.7(A0) U4.8(VCC) U5.8(VCC) U6.5(A2) U6.6(A1) U6.7(A0) U6.8(VCC) ; also sheet 7,8,12,13,14,15,16,17
GND: C5.2 U4.4(GND) U4.EP(GND) U5.1(A0) U5.2(A1) U5.3(A2) U5.4(GND) U5.7(WP) U5.EP U6.4(GND) U6.EP(GND) ; also sheet 2,3,5,7,8,9,10,11,12,13,14,15,16,17
OS2: U6.3(OS)
OS3: U4.3(OS)
SCL1: U6.2(SCL) ; also sheet 10,12
SCL3: U4.2(SCL) ; also sheet 10,14
SCL7: RN4.1 U5.6(SCL) ; also sheet 8,10
SDA1: U6.1(SDA) ; also sheet 10,12
SDA3: U4.1(SDA) ; also sheet 10,14
SDA7: RN4.2 U5.5(SDA) ; also sheet 8,10

### Notes on the sheet
- Temp Sensor | Info EEPROM
- [0x4F]
- Temp Sensor
- [0x4F]
- AXIOM Beta Power Board
- Temperature Sensing and
  Data EEPROM
- Copyright (C) 2014-2018 H.Poetzl
  Licensed under CERN OHL v.1.2

## Sheet 7 of 17
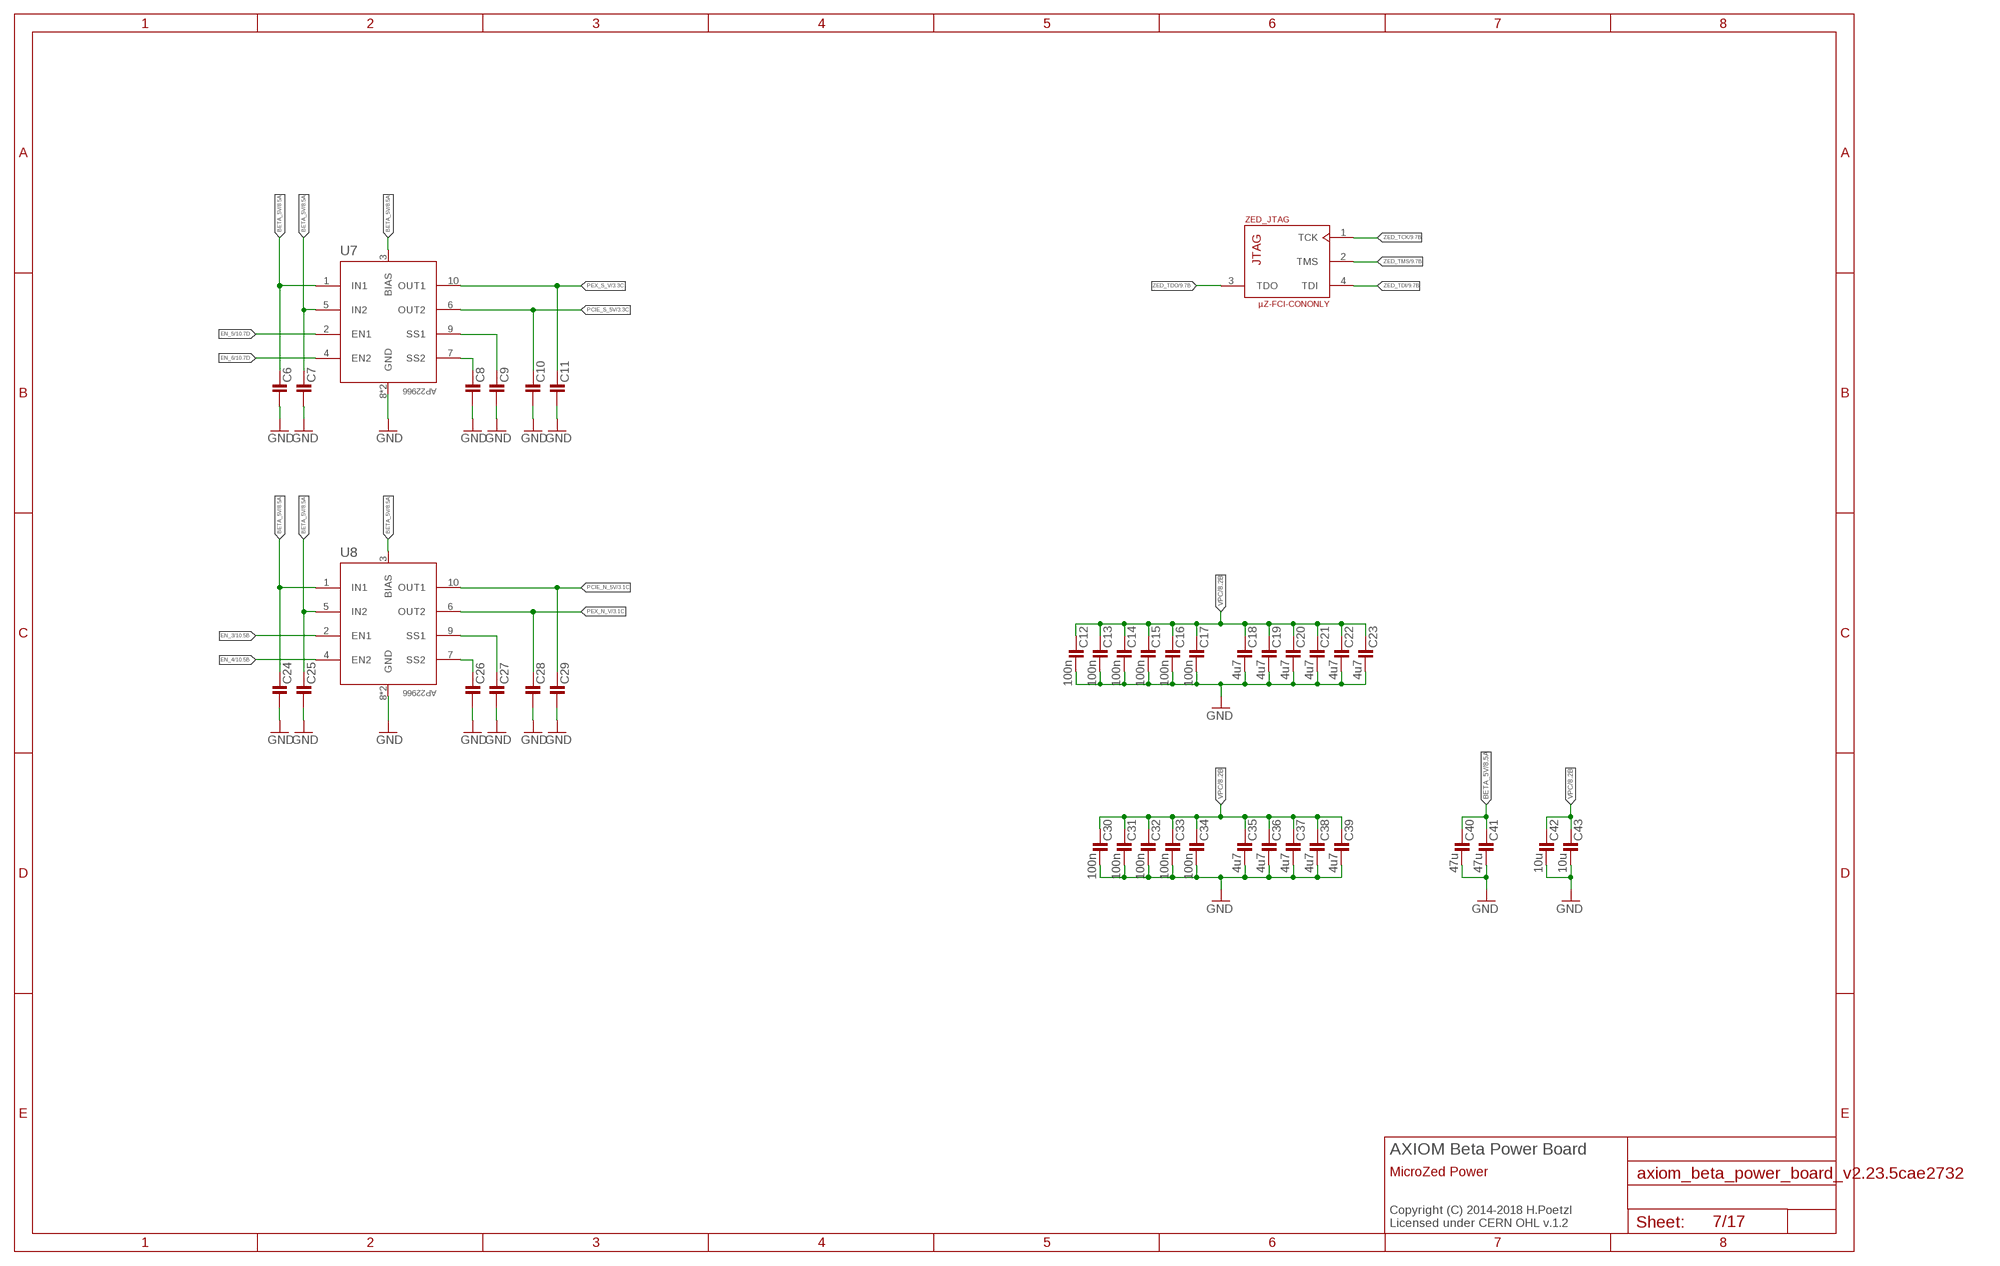
[diagram p7: schematic, sheet 7]

### Parts
C6  C0402-C  [0402-C]
C7  C0402-C  [0402-C]
C8  C0201-C  [0201-C]
C9  C0201-C  [0201-C]
C10  C0402-C  [0402-C]
C11  C0402-C  [0402-C]
C12  100n  C0402-C  [0402-C]
C13  100n  C0402-C  [0402-C]
C14  100n  C0402-C  [0402-C]
C15  100n  C0402-C  [0402-C]
C16  100n  C0402-C  [0402-C]
C17  100n  C0402-C  [0402-C]
C18  4u7  C0402-C  [0402-C]
C19  4u7  C0402-C  [0402-C]
C20  4u7  C0402-C  [0402-C]
C21  4u7  C0402-C  [0402-C]
C22  4u7  C0402-C  [0402-C]
C23  4u7  C0402-C  [0402-C]
C24  C0402-C  [0402-C]
C25  C0402-C  [0402-C]
C26  C0201-C  [0201-C]
C27  C0201-C  [0201-C]
C28  C0402-C  [0402-C]
C29  C0402-C  [0402-C]
C30  100n  C0402-C  [0402-C]
C31  100n  C0402-C  [0402-C]
C32  100n  C0402-C  [0402-C]
C33  100n  C0402-C  [0402-C]
C34  100n  C0402-C  [0402-C]
C35  4u7  C0402-C  [0402-C]
C36  4u7  C0402-C  [0402-C]
C37  4u7  C0402-C  [0402-C]
C38  4u7  C0402-C  [0402-C]
C39  4u7  C0402-C  [0402-C]
C40  47u  C0805-C  [0805-C]
C41  47u  C0805-C  [0805-C]
C42  10u  C0402-C  [0402-C]
C43  10u  C0402-C  [0402-C]
U7  AP22966  [V-DFN3020-14]
U8  AP22966  [V-DFN3020-14]

### Nets
BETA_5V: C6.1 C7.1 C24.1 C25.1 C40.1 C41.1 U7.1(IN1) U7.3(BIAS) U7.5(IN2) U8.1(IN1) U8.3(BIAS) U8.5(IN2) ; also sheet 6,8,12,13,14,15,16,17
EN_3: U8.2(EN1) ; also sheet 10
EN_4: U8.4(EN2) ; also sheet 10
EN_5: U7.2(EN1) ; also sheet 10
EN_6: U7.4(EN2) ; also sheet 10
GND: C6.2 C7.2 C8.2 C9.2 C10.2 C11.2 C12.2 C13.2 C14.2 C15.2 C16.2 C17.2 C18.2 C19.2 C20.2 C21.2 C22.2 C23.2 C24.2 C25.2 C26.2 C27.2 C28.2 C29.2 C30.2 C31.2 C32.2 C33.2 C34.2 C35.2 C36.2 C37.2 C38.2 C39.2 C40.2 C41.2 C42.2 C43.2 U7.8(GND) U7.EP(GND) U8.8(GND) U8.EP(GND) ; also sheet 2,3,5,6,8,9,10,11,12,13,14,15,16,17
N$23: C26.1 U8.7(SS2)
N$24: C27.1 U8.9(SS1)
N$25: C8.1 U7.7(SS2)
N$26: C9.1 U7.9(SS1)
PCIE_N_5V: C29.1 U8.10(OUT1) ; also sheet 3
PCIE_S_5V: C10.1 U7.6(OUT2) ; also sheet 3
PEX_N_V: C28.1 U8.6(OUT2) ; also sheet 3
PEX_S_V: C11.1 U7.10(OUT1) ; also sheet 3
VPC: C12.1 C13.1 C14.1 C15.1 C16.1 C17.1 C18.1 C19.1 C20.1 C21.1 C22.1 C23.1 C30.1 C31.1 C32.1 C33.1 C34.1 C35.1 C36.1 C37.1 C38.1 C39.1 C42.1 C43.1 ; also sheet 5,8,9,10
ZED_TCK: ZED.1(_JTAG:TCK) ; also sheet 9
ZED_TDI: ZED.4(_JTAG:TDI) ; also sheet 9
ZED_TDO: ZED.3(_JTAG:TDO) ; also sheet 9
ZED_TMS: ZED.2(_JTAG:TMS) ; also sheet 9

### Notes on the sheet
- AXIOM Beta Power Board
- MicroZed Power
- Copyright (C) 2014-2018 H.Poetzl
  Licensed under CERN OHL v.1.2

## Sheet 8 of 17
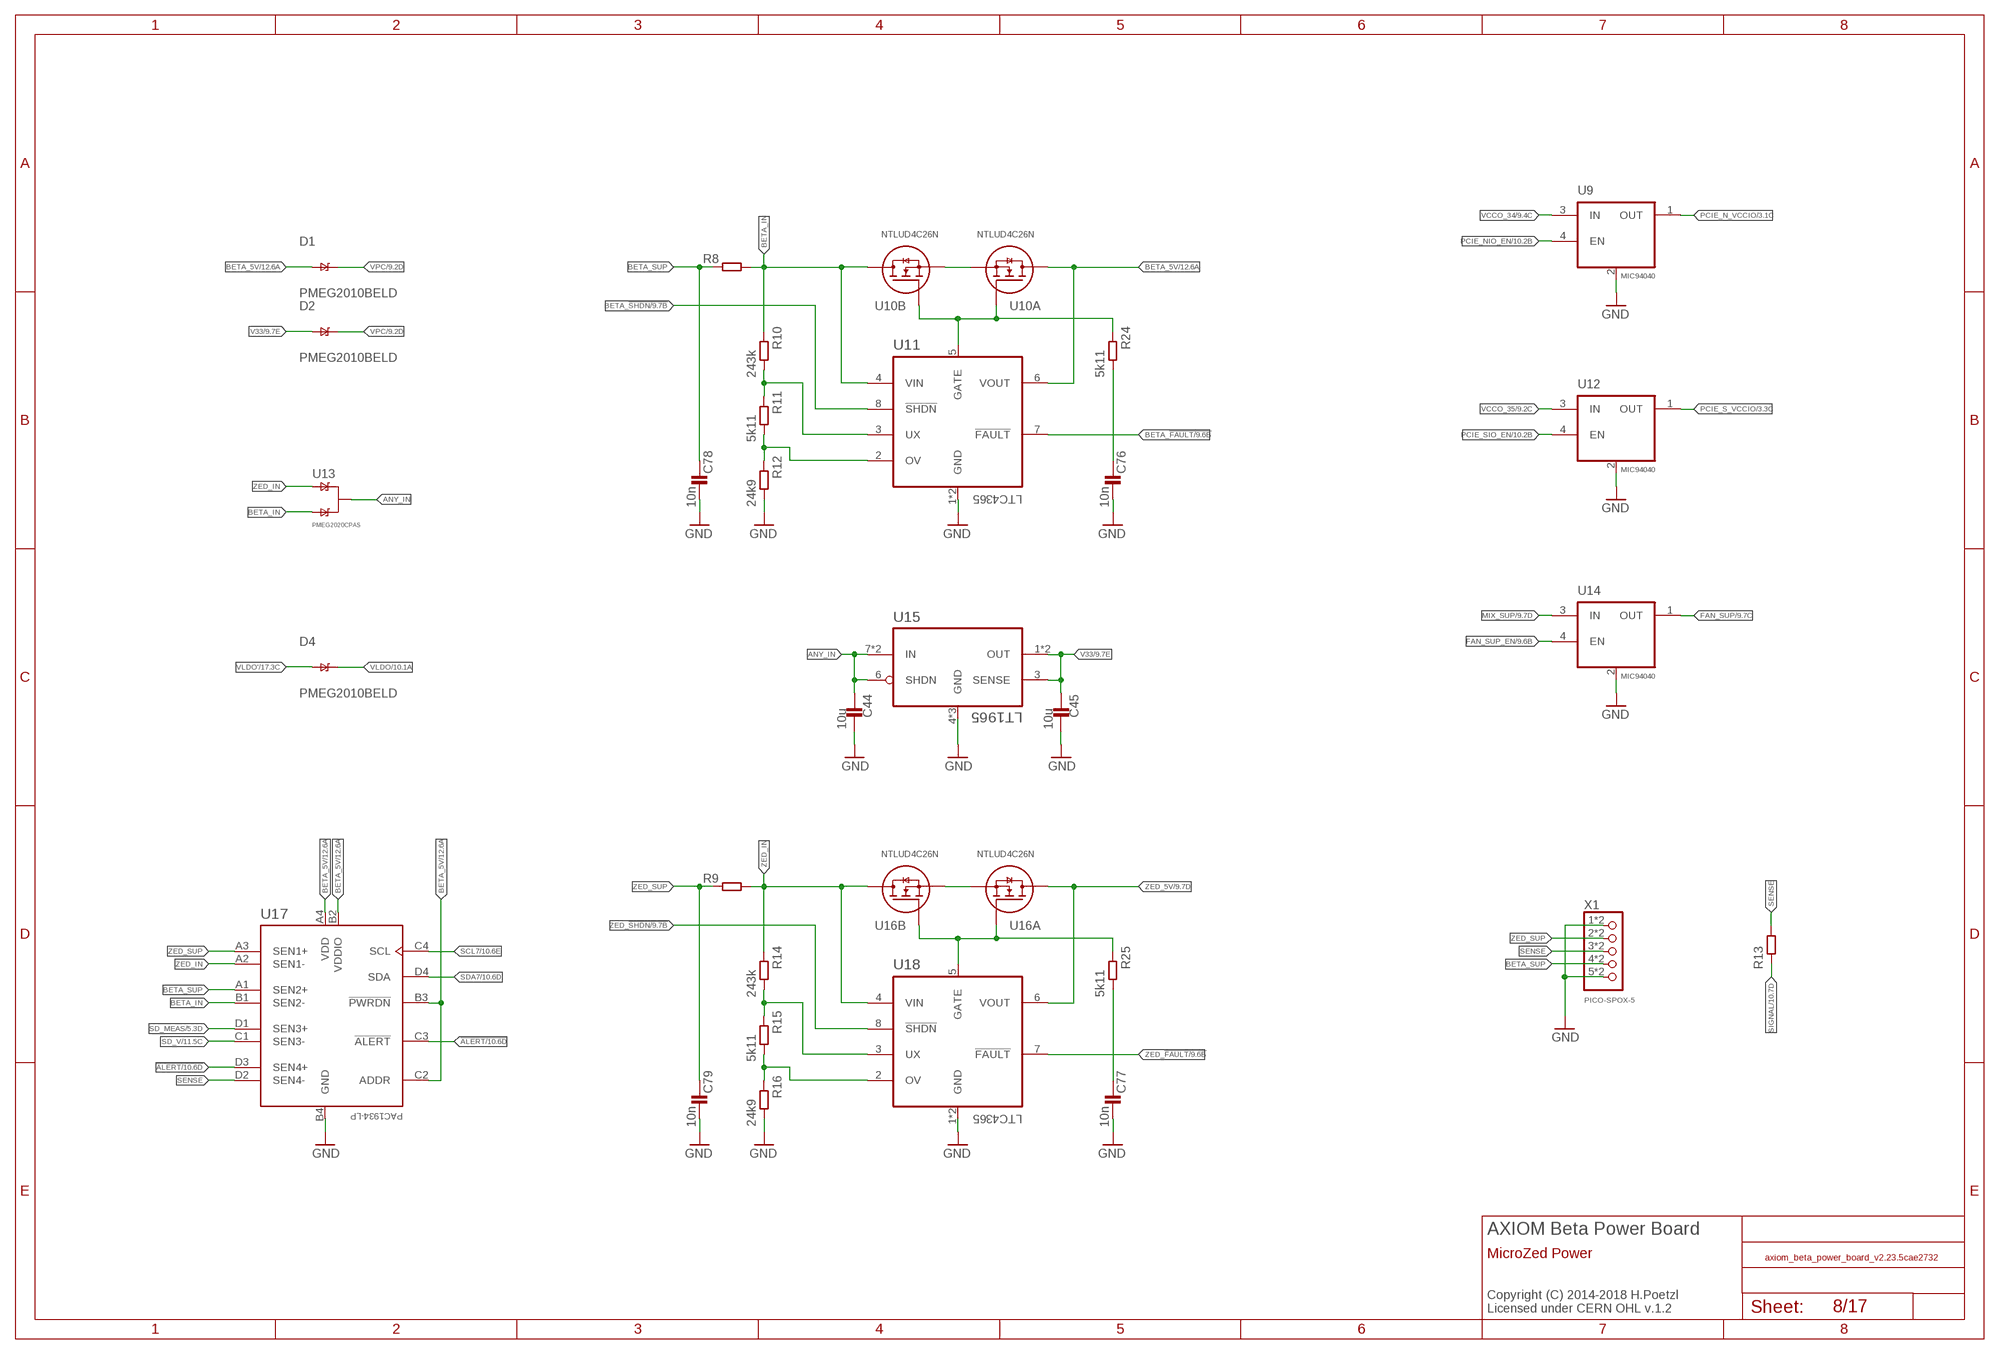
[diagram p8: schematic, sheet 8]

### Parts
C44  10u  C0603-C  [0603-C]
C45  10u  C0603-C  [0603-C]
C76  10n  C0402-C  [0402-C]
C77  10n  C0402-C  [0402-C]
C78  10n  C0402-C  [0402-C]
C79  10n  C0402-C  [0402-C]
D1  PMEG2010BELD  [DFN1006D-2]
D2  PMEG2010BELD  [DFN1006D-2]
D4  PMEG2010BELD  [DFN1006D-2]
R8  R0805-C  [0805-C]
R9  R0805-C  [0805-C]
R10  243k  R0402-C  [0402-C]
R11  5k11  R0402-C  [0402-C]
R12  24k9  R0402-C  [0402-C]
R13  R0402-C  [0402-C]
R14  243k  R0402-C  [0402-C]
R15  5k11  R0402-C  [0402-C]
R16  24k9  R0402-C  [0402-C]
R24  5k11  R0402-C  [0402-C]
R25  5k11  R0402-C  [0402-C]
U9  MIC94040  [MLF-4]
U10  NTLUD4C26N  [UDFN6]
U11  LTC4365  [DFN8]
U12  MIC94040  [MLF-4]
U13  PMEG2020CPAS  [DFN2020D-3]
U14  MIC94040  [MLF-4]
U15  LT1965  [DFN3X3_8LEAD]
U16  NTLUD4C26N  [UDFN6]
U17  PAC1934-LP  [WLCSP-16-LP]
U18  LTC4365  [DFN8]
X1  PICO-SPOX-5  [PICO-SPOX-5]

### Nets
!ALERT: U17.C3(!ALERT) U17.D3(SEN4+) ; also sheet 10
ANY_IN: C44.1 U13.3(K) U13.4(K) U15.6(SHDN) U15.7(IN) U15.8(IN)
BETA_5V: D1.A U10.6(A:D) U10.D1(A:D) U11.6(VOUT) U17.A4(VDD) U17.B2(VDDIO) U17.B3(!PWRDN) U17.C2(ADDR) ; also sheet 6,7,12,13,14,15,16,17
BETA_!FAULT: U11.7(!FAULT) ; also sheet 9
BETA_!SHDN: U11.8(!SHDN) ; also sheet 9
BETA_GATE: R24.1 U10.2(A:G) U10.5(B:G) U11.5(GATE)
BETA_IN: R8.2 R10.1 U10.3(B:D) U10.D2(B:D) U11.4(VIN) U13.2(A2) U17.B1(SEN2-)
BETA_OV: R11.2 R12.1 U11.2(OV)
BETA_SUP: C78.1 R8.1 U17.A1(SEN2+) X1.4 X1.4A
BETA_UV: R10.2 R11.1 U11.3(UX)
FAN_SUP: U14.1(OUT) ; also sheet 9
FAN_SUP_EN: U14.4(EN) ; also sheet 9
GND: C44.2 C45.2 C76.2 C77.2 C78.2 C79.2 R12.2 R16.2 U9.2(GND) U11.1(GND) U11.EP(GND) U12.2(GND) U14.2(GND) U15.4(GND) U15.5(GND) U15.9(GND) U17.B4(GND) U18.1(GND) U18.EP(GND) X1.1 X1.1A X1.5 X1.5A ; also sheet 2,3,5,6,7,9,10,11,12,13,14,15,16,17
MIX_SUP: U14.3(IN) ; also sheet 9
N$7 [LVDS]: C76.1 R24.2
N$14 [LVDS]: C77.1 R25.2
N$18: U10.1(A:S) U10.4(B:S)
N$38: U16.1(A:S) U16.4(B:S)
PCIE_N_VCCIO: U9.1(OUT) ; also sheet 3
PCIE_NIO_EN: U9.4(EN) ; also sheet 10
PCIE_S_VCCIO: U12.1(OUT) ; also sheet 3
PCIE_SIO_EN: U12.4(EN) ; also sheet 10
SCL7: U17.C4(SCL) ; also sheet 6,10
SD_MEAS [LVDS]: U17.D1(SEN3+) ; also sheet 5
SD_V: U17.C1(SEN3-) ; also sheet 5,11
SDA7: U17.D4(SDA) ; also sheet 6,10
SENSE: R13.2 U17.D2(SEN4-) X1.3 X1.3A
SIGNAL [LVDS]: R13.1 ; also sheet 10
V33: C45.1 D2.A U15.1(OUT) U15.2(OUT) U15.3(SENSE) ; also sheet 9
VCCO_34: U9.3(IN) ; also sheet 2,9,10,17
VCCO_35: U12.3(IN) ; also sheet 2,9,10,16
VLDO: D4.C(K) ; also sheet 10,11
VLDO': D4.A ; also sheet 17
VPC: D1.C(K) D2.C(K) ; also sheet 5,7,9,10
ZED_5V: U16.6(A:D) U16.D1(A:D) U18.6(VOUT) ; also sheet 2,9
ZED_!FAULT: U18.7(!FAULT) ; also sheet 9
ZED_!SHDN: U18.8(!SHDN) ; also sheet 9
ZED_GATE: R25.1 U16.2(A:G) U16.5(B:G) U18.5(GATE)
ZED_IN: R9.2 R14.1 U13.1(A1) U16.3(B:D) U16.D2(B:D) U17.A2(SEN1-) U18.4(VIN)
ZED_OV: R15.2 R16.1 U18.2(OV)
ZED_SUP: C79.1 R9.1 U17.A3(SEN1+) X1.2 X1.2A
ZED_UV: R14.2 R15.1 U18.3(UX)

### Notes on the sheet
- AXIOM Beta Power Board
- MicroZed Power
- Copyright (C) 2014-2018 H.Poetzl
  Licensed under CERN OHL v.1.2

## Sheet 9 of 17
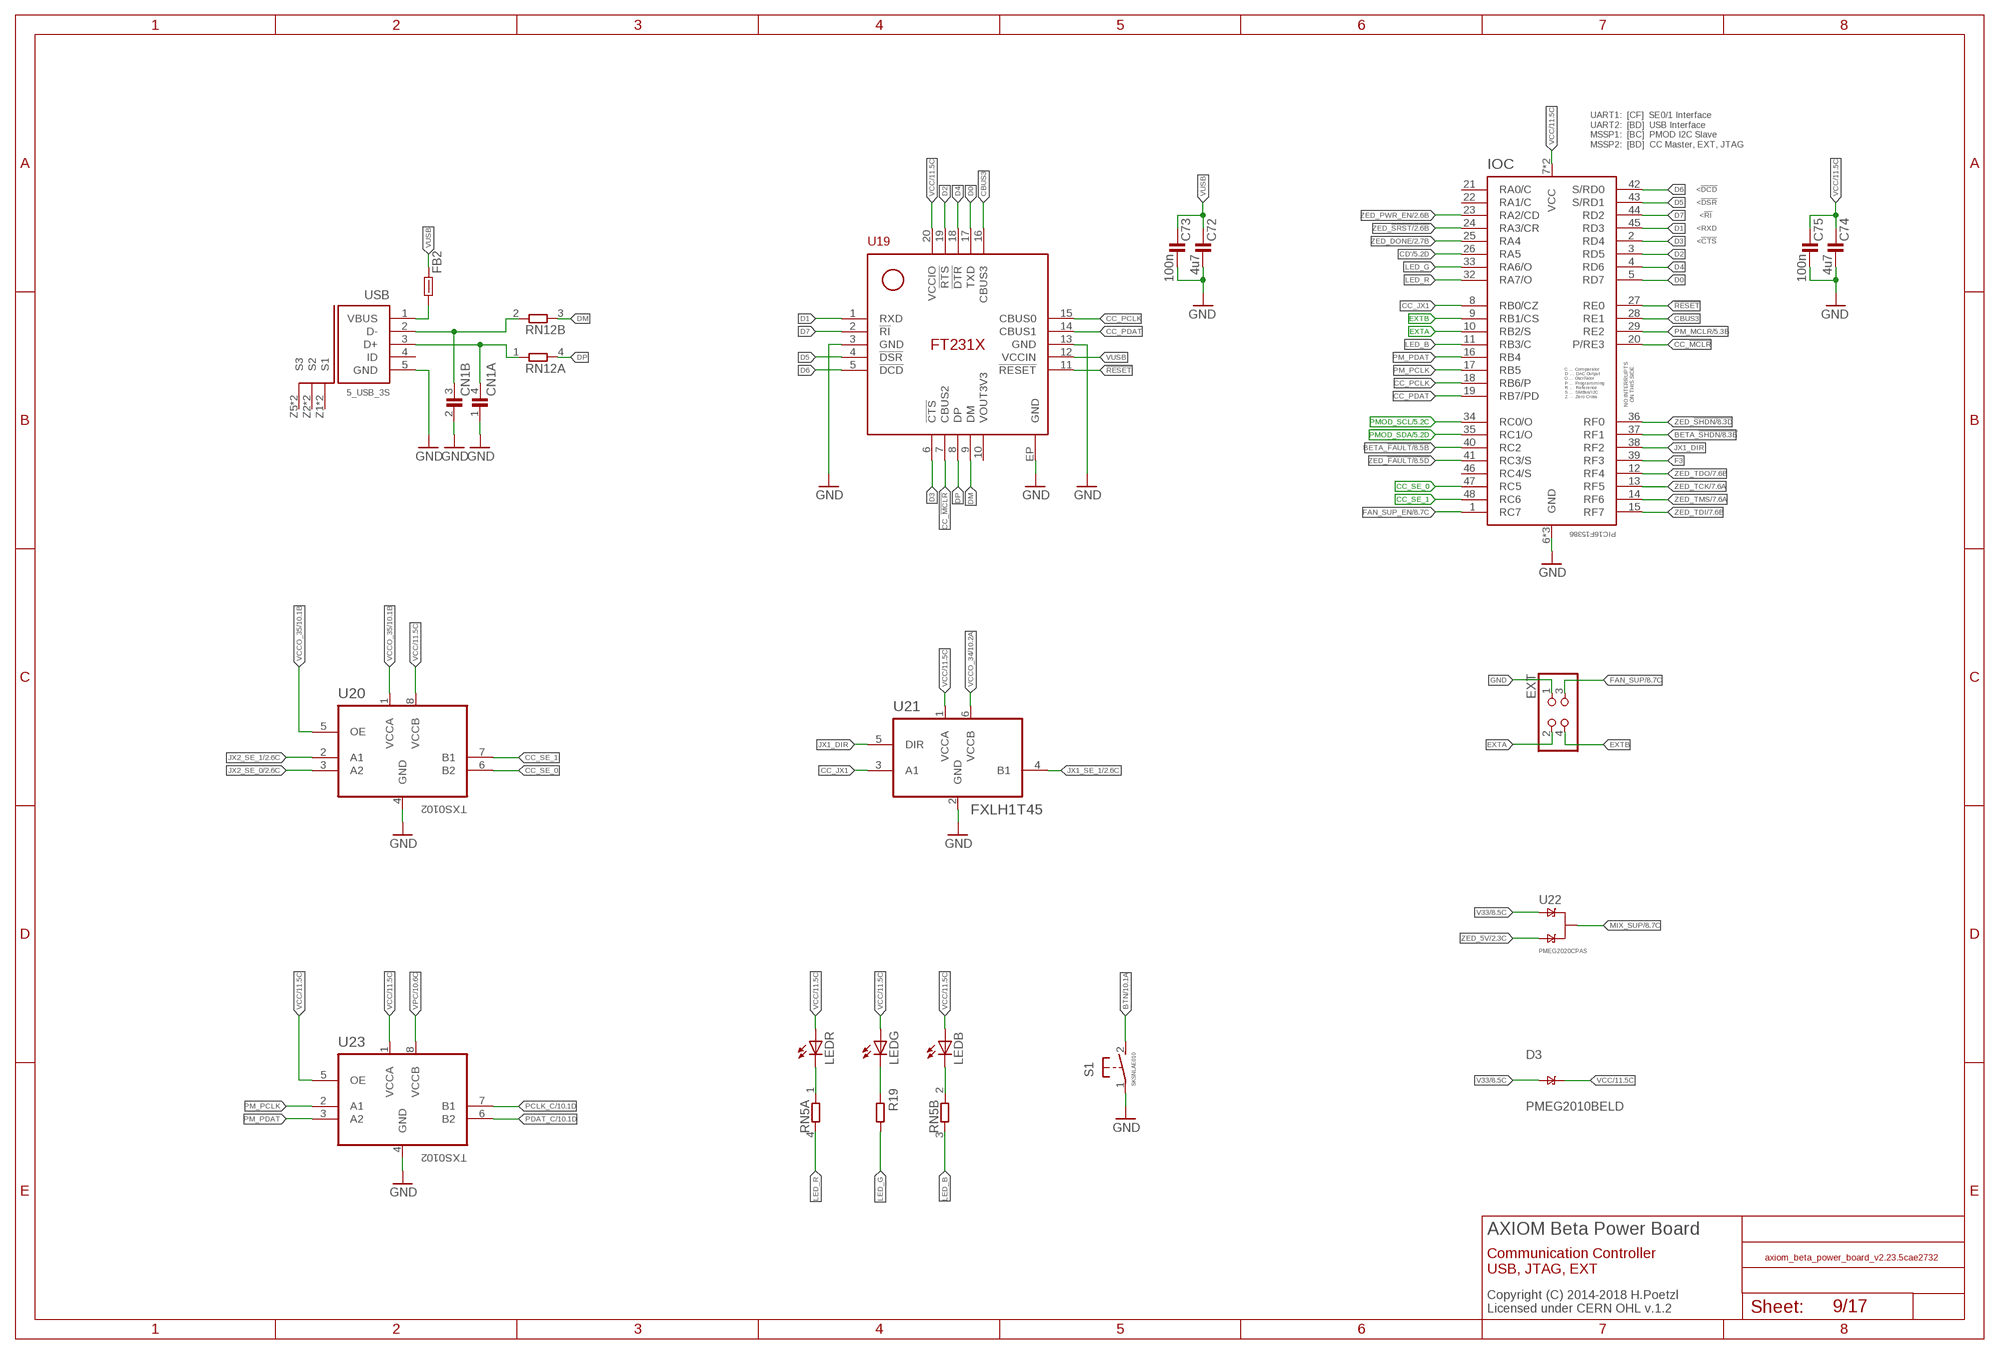
[diagram p9: schematic, sheet 9]

### Parts
C72  4u7  C0402-C  [0402-C]
C73  100n  C0402-C  [0402-C]
C74  4u7  C0402-C  [0402-C]
C75  100n  C0402-C  [0402-C]
CN1  2C-NCC0504  [CC0504]
D3  PMEG2010BELD  [DFN1006D-2]
EXT  PINHD-2X02  [2X02M/90-S]  (not fitted in variant Beta)
FB2  FB0402-C  [0402-C]
IOC  PIC16F15386  PIC16F15386-NSM  [UQFN50P600X600X100-49N-NSM]
LED  MSL0104RGB  RGB-LED-MSL0104-SL  [MSL0104-SL]
R19  R0402-C  [0402-C]
RN5  2R-NEXB24V  [EXB24V]
RN12  2R-NEXB24V  [EXB24V]
S1  SKSNLAE010  [SKSNLAE010]
U19  FT231-NSM  [QFN65P400X400X100-21N-NSM]
U20  TXS0102  [X2SON-8]
U21  FXLH1T45  [MICROPAK-6]
U22  PMEG2020CPAS  [DFN2020D-3]
U23  TXS0102  [X2SON-8]
USB  5_USB_3S  [MICRO-AB-H-SMT]

### Nets
!RESET: IOC.27(RE0) U19.11(!RESET)
BETA_!FAULT: IOC.40(RC2) ; also sheet 8
BETA_!SHDN: IOC.37(RF1) ; also sheet 8
BTN: S1.2 ; also sheet 10
CBUS3: IOC.28(RE1) U19.16(CBUS3)
CC_!MCLR: IOC.20(P/RE3) U19.7(CBUS2)
CC_JX1: IOC.8(RB0/CZ) U21.3(A1)
CC_PCLK: IOC.18(RB6/P) U19.15(CBUS0)
CC_PDAT: IOC.19(RB7/PD) U19.14(CBUS1)
CC_SE_0: IOC.47(RC5) U20.6(B2)
CC_SE_1: IOC.48(RC6) U20.7(B1)
CD': IOC.26(RA5) ; also sheet 5
D0: IOC.5(RD7) U19.17(TXD)
D1: IOC.45(RD3) U19.1(RXD)
D2: IOC.3(RD5) U19.19(!RTS)
D3: IOC.2(RD4) U19.6(!CTS)
D4: IOC.4(RD6) U19.18(!DTR)
D5: IOC.43(S/RD1) U19.4(!DSR)
D6: IOC.42(S/RD0) U19.5(!DCD)
D7: IOC.44(RD2) U19.2(!RI)
DM: RN12.3 U19.9(DM)
DP: RN12.4 U19.8(DP)
EXTA: EXT.2 IOC.10(RB2/S)
EXTB: EXT.4 IOC.9(RB1/CS)
F3: IOC.39(RF3)
FAN_SUP: EXT.3 ; also sheet 8
FAN_SUP_EN: IOC.1(RC7) ; also sheet 8
GND: C72.2 C73.2 C74.2 C75.2 CN1.1 CN1.2 EXT.1 IOC.6(GND) IOC.31(GND) IOC.EP(GND) S1.1 U19.3(GND) U19.13(GND) U19.EP(GND) U20.4(GND) U21.2(GND) U23.4(GND) USB.5(GND) ; also sheet 2,3,5,6,7,8,10,11,12,13,14,15,16,17
JX1_DIR: IOC.38(RF2) U21.5(DIR)
JX1_SE_1: U21.4(B1) ; also sheet 2,3
JX2_SE_0: U20.3(A2) ; also sheet 2
JX2_SE_1: U20.2(A1) ; also sheet 2
LED_B: IOC.11(RB3/C) RN5.3
LED_G: IOC.33(RA6/O) R19.2
LED_G': LED.3(G:C) R19.1
LED_R: IOC.32(RA7/O) RN5.4
MIX_SUP: U22.3(K) U22.4(K) ; also sheet 8
N$4 [LVDS]: LED.4(R:C) RN5.1
N$8 [LVDS]: LED.5(B:C) RN5.2
N$12: CN1.3 RN12.2 USB.2(D-)
N$17: CN1.4 RN12.1 USB.3(D+)
PCLK_C: U23.7(B1) ; also sheet 10
PDAT_C: U23.6(B2) ; also sheet 10
PM_MCLR [LVDS]: IOC.29(RE2) ; also sheet 5
PM_PCLK: IOC.17(RB5) U23.2(A1)
PM_PDAT: IOC.16(RB4) U23.3(A2)
PMOD_SCL: IOC.34(RC0/O) ; also sheet 5
PMOD_SDA: IOC.35(RC1/O) ; also sheet 5
V33: D3.A U22.1(A1) ; also sheet 8
VBUS: FB2.2 USB.1(VBUS)
VCC: C74.1 C75.1 D3.C(K) IOC.7(VCC) IOC.30(VCC) LED.1(R:A) LED.2(G:A) LED.6(B:A) LED.7(R:A) U19.20(VCCIO) U20.8(VCCB) U21.1(VCCA) U23.1(VCCA) U23.5(OE) ; also sheet 5,11
VCCO_34: U21.6(VCCB) ; also sheet 2,8,10,17
VCCO_35: U20.1(VCCA) U20.5(OE) ; also sheet 2,8,10,16
VPC: U23.8(VCCB) ; also sheet 5,7,8,10
VUSB: C72.1 C73.1 FB2.1 U19.12(VCCIN)
ZED_5V: U22.2(A2) ; also sheet 2,8
ZED_!FAULT: IOC.41(RC3/S) ; also sheet 8
ZED_!SHDN: IOC.36(RF0) ; also sheet 8
ZED_!SRST: IOC.24(RA3/CR) ; also sheet 2
ZED_DONE: IOC.25(RA4) ; also sheet 2,3
ZED_PWR_EN: IOC.23(RA2/CD) ; also sheet 2
ZED_TCK: IOC.13(RF5) ; also sheet 7
ZED_TDI: IOC.15(RF7) ; also sheet 7
ZED_TDO: IOC.12(RF4) ; also sheet 7
ZED_TMS: IOC.14(RF6) ; also sheet 7
Unconnected: IOC.21(RA0/C) IOC.22(RA1/C) IOC.46(RC4/S) U19.10(VOUT3V3) USB.4(ID) USB.Z1(S1) USB.Z2(S2) USB.Z3(S2) USB.Z4(S1) USB.Z5(S3) USB.Z6(S3)

### Notes on the sheet
- UART1:  [CF]  SE0/1 Interface
  UART2:  [BD]  USB Interface 
  MSSP1:  [BC]  PMOD I2C Slave
  MSSP2:  [BD]  CC Master, EXT, JTAG
- <!DCD
- <!DSR
- <!RI!
- <RXD
- <!CTS
- AXIOM Beta Power Board
- Communication Controller
  USB, JTAG, EXT
- Copyright (C) 2014-2018 H.Poetzl
  Licensed under CERN OHL v.1.2

## Sheet 10 of 17
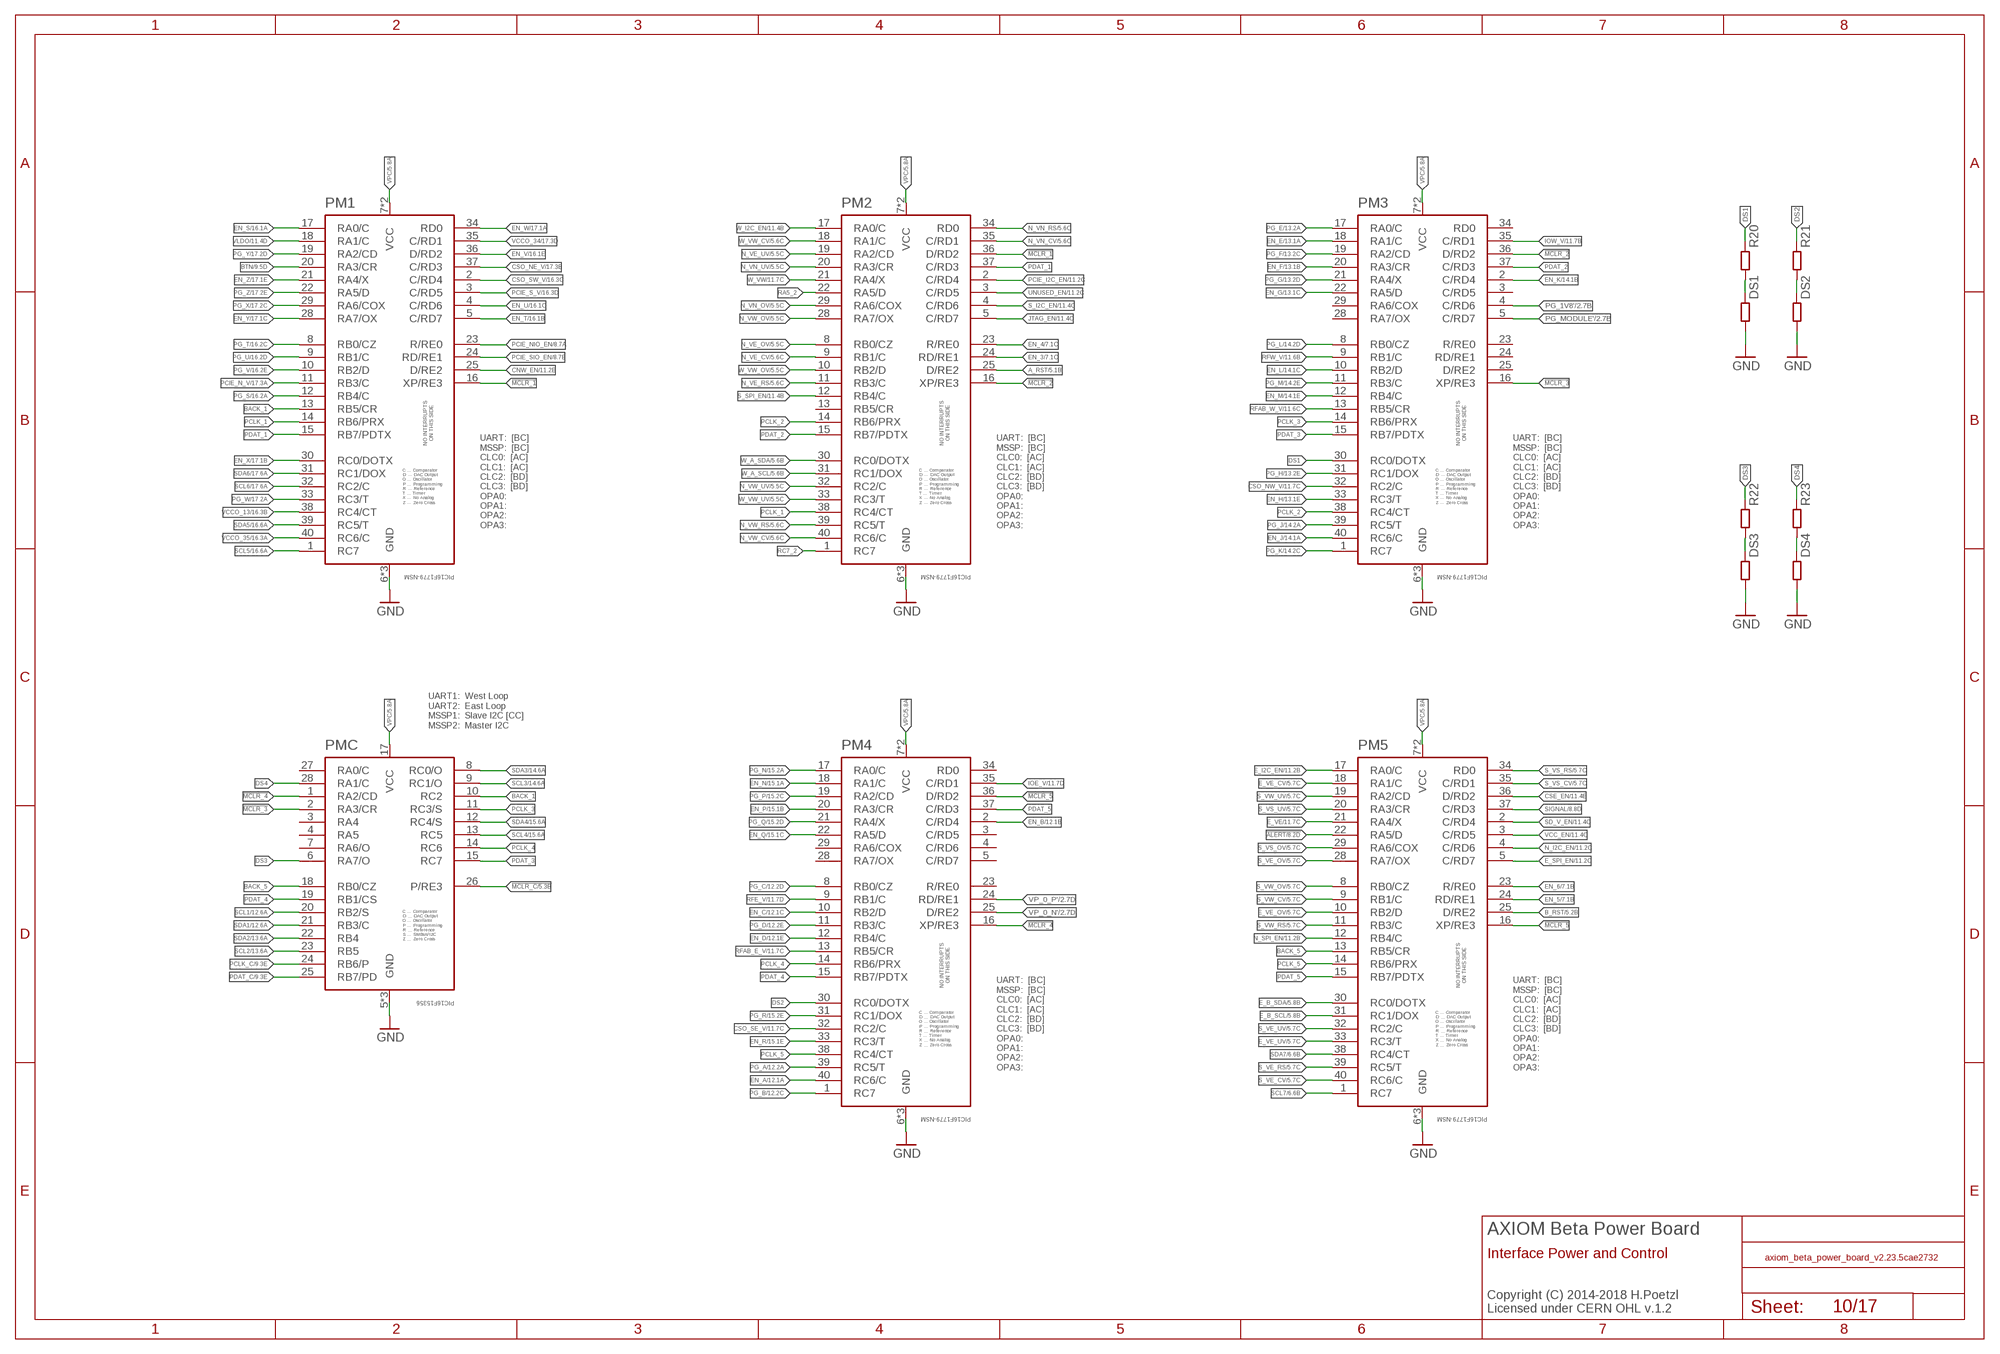
[diagram p10: schematic, sheet 10]

### Parts
DS1  R0402-C  [0402-C]
DS2  R0402-C  [0402-C]
DS3  R0402-C  [0402-C]
DS4  R0402-C  [0402-C]
PM1  PIC16F1779-NSM  [UQFN40P500X500X100-41N-NSM]
PM2  PIC16F1779-NSM  [UQFN40P500X500X100-41N-NSM]
PM3  PIC16F1779-NSM  [UQFN40P500X500X100-41N-NSM]
PM4  PIC16F1779-NSM  [UQFN40P500X500X100-41N-NSM]
PM5  PIC16F1779-NSM  [UQFN40P500X500X100-41N-NSM]
PMC  PIC16F15356  [UQFN50P400X400X100-29N-NSM]
R20  R0402-C  [0402-C]
R21  R0402-C  [0402-C]
R22  R0402-C  [0402-C]
R23  R0402-C  [0402-C]

### Nets
!ALERT: PM5.22(RA5/D) ; also sheet 8
!MCLR_1: PM1.16(XP/RE3) PM2.36(D/RD2)
!MCLR_2: PM2.16(XP/RE3) PM3.36(D/RD2)
!MCLR_3: PM3.16(XP/RE3) PMC.2(RA3/CR)
!MCLR_4: PM4.16(XP/RE3) PMC.1(RA2/CD)
!MCLR_5: PM4.36(D/RD2) PM5.16(XP/RE3)
!MCLR_C: PMC.26(P/RE3) ; also sheet 5
A_RST [LVDS]: PM2.25(D/RE2) ; also sheet 5
B_RST [LVDS]: PM5.25(D/RE2) ; also sheet 5
BACK_1: PM1.13(RB5/CR) PMC.10(RC2)
BACK_5: PM5.13(RB5/CR) PMC.18(RB0/CZ)
BTN: PM1.20(RA3/CR) ; also sheet 9
CNW_EN: PM1.25(D/RE2) ; also sheet 11
CSE_EN: PM5.36(D/RD2) ; also sheet 11
CSO_NE_V: PM1.37(C/RD3) ; also sheet 3,17
CSO_NW_V: PM3.32(RC2/C) ; also sheet 11,13
CSO_SE_V: PM4.32(RC2/C) ; also sheet 11,15
CSO_SW_V: PM1.2(C/RD4) ; also sheet 3,16
DS1: PM3.30(RC0/DOTX) R20.1
DS2: PM4.30(RC0/DOTX) R21.1
DS3: PMC.6(RA7/O) R22.1
DS4: PMC.28(RA1/C) R23.1
E_B_SCL: PM5.31(RC1/DOX) ; also sheet 5
E_B_SDA: PM5.30(RC0/DOTX) ; also sheet 5
E_I2C_EN: PM5.17(RA0/C) ; also sheet 11
E_SPI_EN: PM5.5(C/RD7) ; also sheet 11
E_VE: PM5.21(RA4/X) ; also sheet 11,14
E_VE_CV: PM5.18(RA1/C) ; also sheet 5
E_VE_OV: PM5.10(RB2/D) ; also sheet 5
E_VE_UV: PM5.33(RC3/T) ; also sheet 5
EN_3: PM2.24(RD/RE1) ; also sheet 7
EN_4: PM2.23(R/RE0) ; also sheet 7
EN_5: PM5.24(RD/RE1) ; also sheet 7
EN_6: PM5.23(R/RE0) ; also sheet 7
EN_A: PM4.40(RC6/C) ; also sheet 12
EN_B: PM4.2(C/RD4) ; also sheet 12
EN_C: PM4.10(RB2/D) ; also sheet 12
EN_D: PM4.12(RB4/C) ; also sheet 12
EN_E: PM3.18(RA1/C) ; also sheet 13
EN_F: PM3.20(RA3/CR) ; also sheet 13
EN_G: PM3.22(RA5/D) ; also sheet 13
EN_H: PM3.33(RC3/T) ; also sheet 13
EN_J: PM3.40(RC6/C) ; also sheet 14
EN_K: PM3.2(C/RD4) ; also sheet 14
EN_L: PM3.10(RB2/D) ; also sheet 14
EN_M: PM3.12(RB4/C) ; also sheet 14
EN_N: PM4.18(RA1/C) ; also sheet 15
EN_P: PM4.20(RA3/CR) ; also sheet 15
EN_Q: PM4.22(RA5/D) ; also sheet 15
EN_R: PM4.33(RC3/T) ; also sheet 15
EN_S: PM1.17(RA0/C) ; also sheet 16
EN_T: PM1.5(C/RD7) ; also sheet 16
EN_U: PM1.4(C/RD6) ; also sheet 16
EN_V: PM1.36(D/RD2) ; also sheet 16
EN_W: PM1.34(RD0) ; also sheet 17
EN_X: PM1.30(RC0/DOTX) ; also sheet 17
EN_Y: PM1.28(RA7/OX) ; also sheet 17
EN_Z: PM1.21(RA4/X) ; also sheet 17
GND: DS1.2 DS2.2 DS3.2 DS4.2 PM1.6(GND) PM1.27(GND) PM1.EP(GND) PM2.6(GND) PM2.27(GND) PM2.EP(GND) PM3.6(GND) PM3.27(GND) PM3.EP(GND) PM4.6(GND) PM4.27(GND) PM4.EP(GND) PM5.6(GND) PM5.27(GND) PM5.EP(GND) PMC.5(GND) PMC.16(GND) PMC.EP(GND) ; also sheet 2,3,5,6,7,8,9,11,12,13,14,15,16,17
IOE_V: PM4.35(C/RD1) ; also sheet 5,11,15
IOW_V: PM3.35(C/RD1) ; also sheet 5,11,13
JTAG_EN: PM2.5(C/RD7) ; also sheet 11
N$1: DS2.1 R21.2
N$2: DS4.1 R23.2
N$28: DS1.1 R20.2
N$29: DS3.1 R22.2
N_I2C_EN: PM5.4(C/RD6) ; also sheet 11
N_SPI_EN: PM5.12(RB4/C) ; also sheet 11
N_VE_CV: PM2.9(RB1/C) ; also sheet 5
N_VE_OV: PM2.8(RB0/CZ) ; also sheet 5
N_VE_RS: PM2.11(RB3/C) ; also sheet 5
N_VE_UV: PM2.19(RA2/CD) ; also sheet 5
N_VN_CV: PM2.35(C/RD1) ; also sheet 5
N_VN_OV: PM2.29(RA6/COX) ; also sheet 5
N_VN_RS: PM2.34(RD0) ; also sheet 5
N_VN_UV: PM2.20(RA3/CR) ; also sheet 5
N_VW_CV: PM2.40(RC6/C) ; also sheet 5
N_VW_OV: PM2.28(RA7/OX) ; also sheet 5
N_VW_RS: PM2.39(RC5/T) ; also sheet 5
N_VW_UV: PM2.32(RC2/C) ; also sheet 5
PCIE_I2C_EN: PM2.2(C/RD4) ; also sheet 11
PCIE_N_V: PM1.11(RB3/C) ; also sheet 3,17
PCIE_NIO_EN: PM1.23(R/RE0) ; also sheet 8
PCIE_S_V: PM1.3(C/RD5) ; also sheet 3,16
PCIE_SIO_EN: PM1.24(RD/RE1) ; also sheet 8
PCLK_1: PM1.14(RB6/PRX) PM2.38(RC4/CT)
PCLK_2: PM2.14(RB6/PRX) PM3.38(RC4/CT)
PCLK_3: PM3.14(RB6/PRX) PMC.11(RC3/S)
PCLK_4: PM4.14(RB6/PRX) PMC.14(RC6)
PCLK_5: PM4.38(RC4/CT) PM5.14(RB6/PRX)
PCLK_C: PMC.24(RB6/P) ; also sheet 9
PDAT_1: PM1.15(RB7/PDTX) PM2.37(C/RD3)
PDAT_2: PM2.15(RB7/PDTX) PM3.37(C/RD3)
PDAT_3: PM3.15(RB7/PDTX) PMC.15(RC7)
PDAT_4: PM4.15(RB7/PDTX) PMC.19(RB1/CS)
PDAT_5: PM4.37(C/RD3) PM5.15(RB7/PDTX)
PDAT_C: PMC.25(RB7/PD) ; also sheet 9
PG_1V8': PM3.4(C/RD6) ; also sheet 2
PG_A: PM4.39(RC5/T) ; also sheet 12
PG_B: PM4.1(RC7) ; also sheet 12
PG_C: PM4.8(RB0/CZ) ; also sheet 12
PG_D: PM4.11(RB3/C) ; also sheet 12
PG_E: PM3.17(RA0/C) ; also sheet 13
PG_F: PM3.19(RA2/CD) ; also sheet 13
PG_G: PM3.21(RA4/X) ; also sheet 13
PG_H: PM3.31(RC1/DOX) ; also sheet 13
PG_J: PM3.39(RC5/T) ; also sheet 14
PG_K: PM3.1(RC7) ; also sheet 14
PG_L: PM3.8(RB0/CZ) ; also sheet 14
PG_M: PM3.11(RB3/C) ; also sheet 14
PG_MODULE': PM3.5(C/RD7) ; also sheet 2
PG_N: PM4.17(RA0/C) ; also sheet 15
PG_P: PM4.19(RA2/CD) ; also sheet 15
PG_Q: PM4.21(RA4/X) ; also sheet 15
PG_R: PM4.31(RC1/DOX) ; also sheet 15
PG_S: PM1.12(RB4/C) ; also sheet 16
PG_T: PM1.8(RB0/CZ) ; also sheet 16
PG_U: PM1.9(RB1/C) ; also sheet 16
PG_V: PM1.10(RB2/D) ; also sheet 16
PG_W: PM1.33(RC3/T) ; also sheet 17
PG_X: PM1.29(RA6/COX) ; also sheet 17
PG_Y: PM1.19(RA2/CD) ; also sheet 17
PG_Z: PM1.22(RA5/D) ; also sheet 17
RA5_2: PM2.22(RA5/D)
RC7_2: PM2.1(RC7)
RFAB_E_V: PM4.13(RB5/CR) ; also sheet 11,15
RFAB_W_V: PM3.13(RB5/CR) ; also sheet 11,13
RFE_V: PM4.9(RB1/C) ; also sheet 11,15
RFW_V: PM3.9(RB1/C) ; also sheet 11,13
S_I2C_EN: PM2.4(C/RD6) ; also sheet 11
S_SPI_EN: PM2.12(RB4/C) ; also sheet 11
S_VE_CV: PM5.40(RC6/C) ; also sheet 5
S_VE_OV: PM5.28(RA7/OX) ; also sheet 5
S_VE_RS: PM5.39(RC5/T) ; also sheet 5
S_VE_UV: PM5.32(RC2/C) ; also sheet 5
S_VS_CV: PM5.35(C/RD1) ; also sheet 5
S_VS_OV: PM5.29(RA6/COX) ; also sheet 5
S_VS_RS: PM5.34(RD0) ; also sheet 5
S_VS_UV: PM5.20(RA3/CR) ; also sheet 5
S_VW_CV: PM5.9(RB1/C) ; also sheet 5
S_VW_OV: PM5.8(RB0/CZ) ; also sheet 5
S_VW_RS: PM5.11(RB3/C) ; also sheet 5
S_VW_UV: PM5.19(RA2/CD) ; also sheet 5
SCL1: PMC.20(RB2/S) ; also sheet 6,12
SCL2: PMC.23(RB5) ; also sheet 13
SCL3: PMC.9(RC1/O) ; also sheet 6,14
SCL4: PMC.13(RC5) ; also sheet 15
SCL5: PM1.1(RC7) ; also sheet 16
SCL6: PM1.32(RC2/C) ; also sheet 17
SCL7: PM5.1(RC7) ; also sheet 6,8
SD_V_EN: PM5.2(C/RD4) ; also sheet 11
SDA1: PMC.21(RB3/C) ; also sheet 6,12
SDA2: PMC.22(RB4) ; also sheet 13
SDA3: PMC.8(RC0/O) ; also sheet 6,14
SDA4: PMC.12(RC4/S) ; also sheet 15
SDA5: PM1.39(RC5/T) ; also sheet 16
SDA6: PM1.31(RC1/DOX) ; also sheet 17
SDA7: PM5.38(RC4/CT) ; also sheet 6,8
SIGNAL [LVDS]: PM5.37(C/RD3) ; also sheet 8
UNUSED_EN: PM2.3(C/RD5) ; also sheet 11
VCC_EN: PM5.3(C/RD5) ; also sheet 11
VCCO_13 [LVDS]: PM1.38(RC4/CT) ; also sheet 2,16
VCCO_34: PM1.35(C/RD1) ; also sheet 2,8,9,17
VCCO_35: PM1.40(RC6/C) ; also sheet 2,8,9,16
VLDO: PM1.18(RA1/C) ; also sheet 8,11
VP_0_N': PM4.25(D/RE2) ; also sheet 2
VP_0_P': PM4.24(RD/RE1) ; also sheet 2
VPC: PM1.7(VCC) PM1.26(VCC) PM2.7(VCC) PM2.26(VCC) PM3.7(VCC) PM3.26(VCC) PM4.7(VCC) PM4.26(VCC) PM5.7(VCC) PM5.26(VCC) PMC.17(VCC) ; also sheet 5,7,8,9
W_A_SCL: PM2.31(RC1/DOX) ; also sheet 5
W_A_SDA: PM2.30(RC0/DOTX) ; also sheet 5
W_I2C_EN: PM2.17(RA0/C) ; also sheet 11
W_VW: PM2.21(RA4/X) ; also sheet 11,12
W_VW_CV: PM2.18(RA1/C) ; also sheet 5
W_VW_OV: PM2.10(RB2/D) ; also sheet 5
W_VW_UV: PM2.33(RC3/T) ; also sheet 5
Unconnected: PM2.13(RB5/CR) PM3.3(C/RD5) PM3.23(R/RE0) PM3.24(RD/RE1) PM3.25(D/RE2) PM3.28(RA7/OX) PM3.29(RA6/COX) PM3.34(RD0) PM4.3(C/RD5) PM4.4(C/RD6) PM4.5(C/RD7) PM4.23(R/RE0) PM4.28(RA7/OX) PM4.29(RA6/COX) PM4.34(RD0) PMC.3(RA4) PMC.4(RA5) PMC.7(RA6/O) PMC.27(RA0/C)

### Notes on the sheet
- UART:  [BC]  
  MSSP:  [BC]  
  CLC0:  [AC]  
  CLC1:  [AC]  
  CLC2:  [BD]
  CLC3:  [BD]
  OPA0:
  OPA1:
  OPA2:
  OPA3:
- UART:  [BC]  
  MSSP:  [BC]  
  CLC0:  [AC]  
  CLC1:  [AC]  
  CLC2:  [BD]
  CLC3:  [BD]
  OPA0:
  OPA1:
  OPA2:
  OPA3:
- UART:  [BC]  
  MSSP:  [BC]  
  CLC0:  [AC]  
  CLC1:  [AC]  
  CLC2:  [BD]
  CLC3:  [BD]
  OPA0:
  OPA1:
  OPA2:
  OPA3:
- UART1:  West Loop
  UART2:  East Loop
  MSSP1:  Slave I2C [CC]
  MSSP2:  Master I2C
- UART:  [BC]  
  MSSP:  [BC]  
  CLC0:  [AC]  
  CLC1:  [AC]  
  CLC2:  [BD]
  CLC3:  [BD]
  OPA0:
  OPA1:
  OPA2:
  OPA3:
- UART:  [BC]  
  MSSP:  [BC]  
  CLC0:  [AC]  
  CLC1:  [AC]  
  CLC2:  [BD]
  CLC3:  [BD]
  OPA0:
  OPA1:
  OPA2:
  OPA3:
- AXIOM Beta Power Board
- Interface Power and Control
- Copyright (C) 2014-2018 H.Poetzl
  Licensed under CERN OHL v.1.2

## Sheet 11 of 17
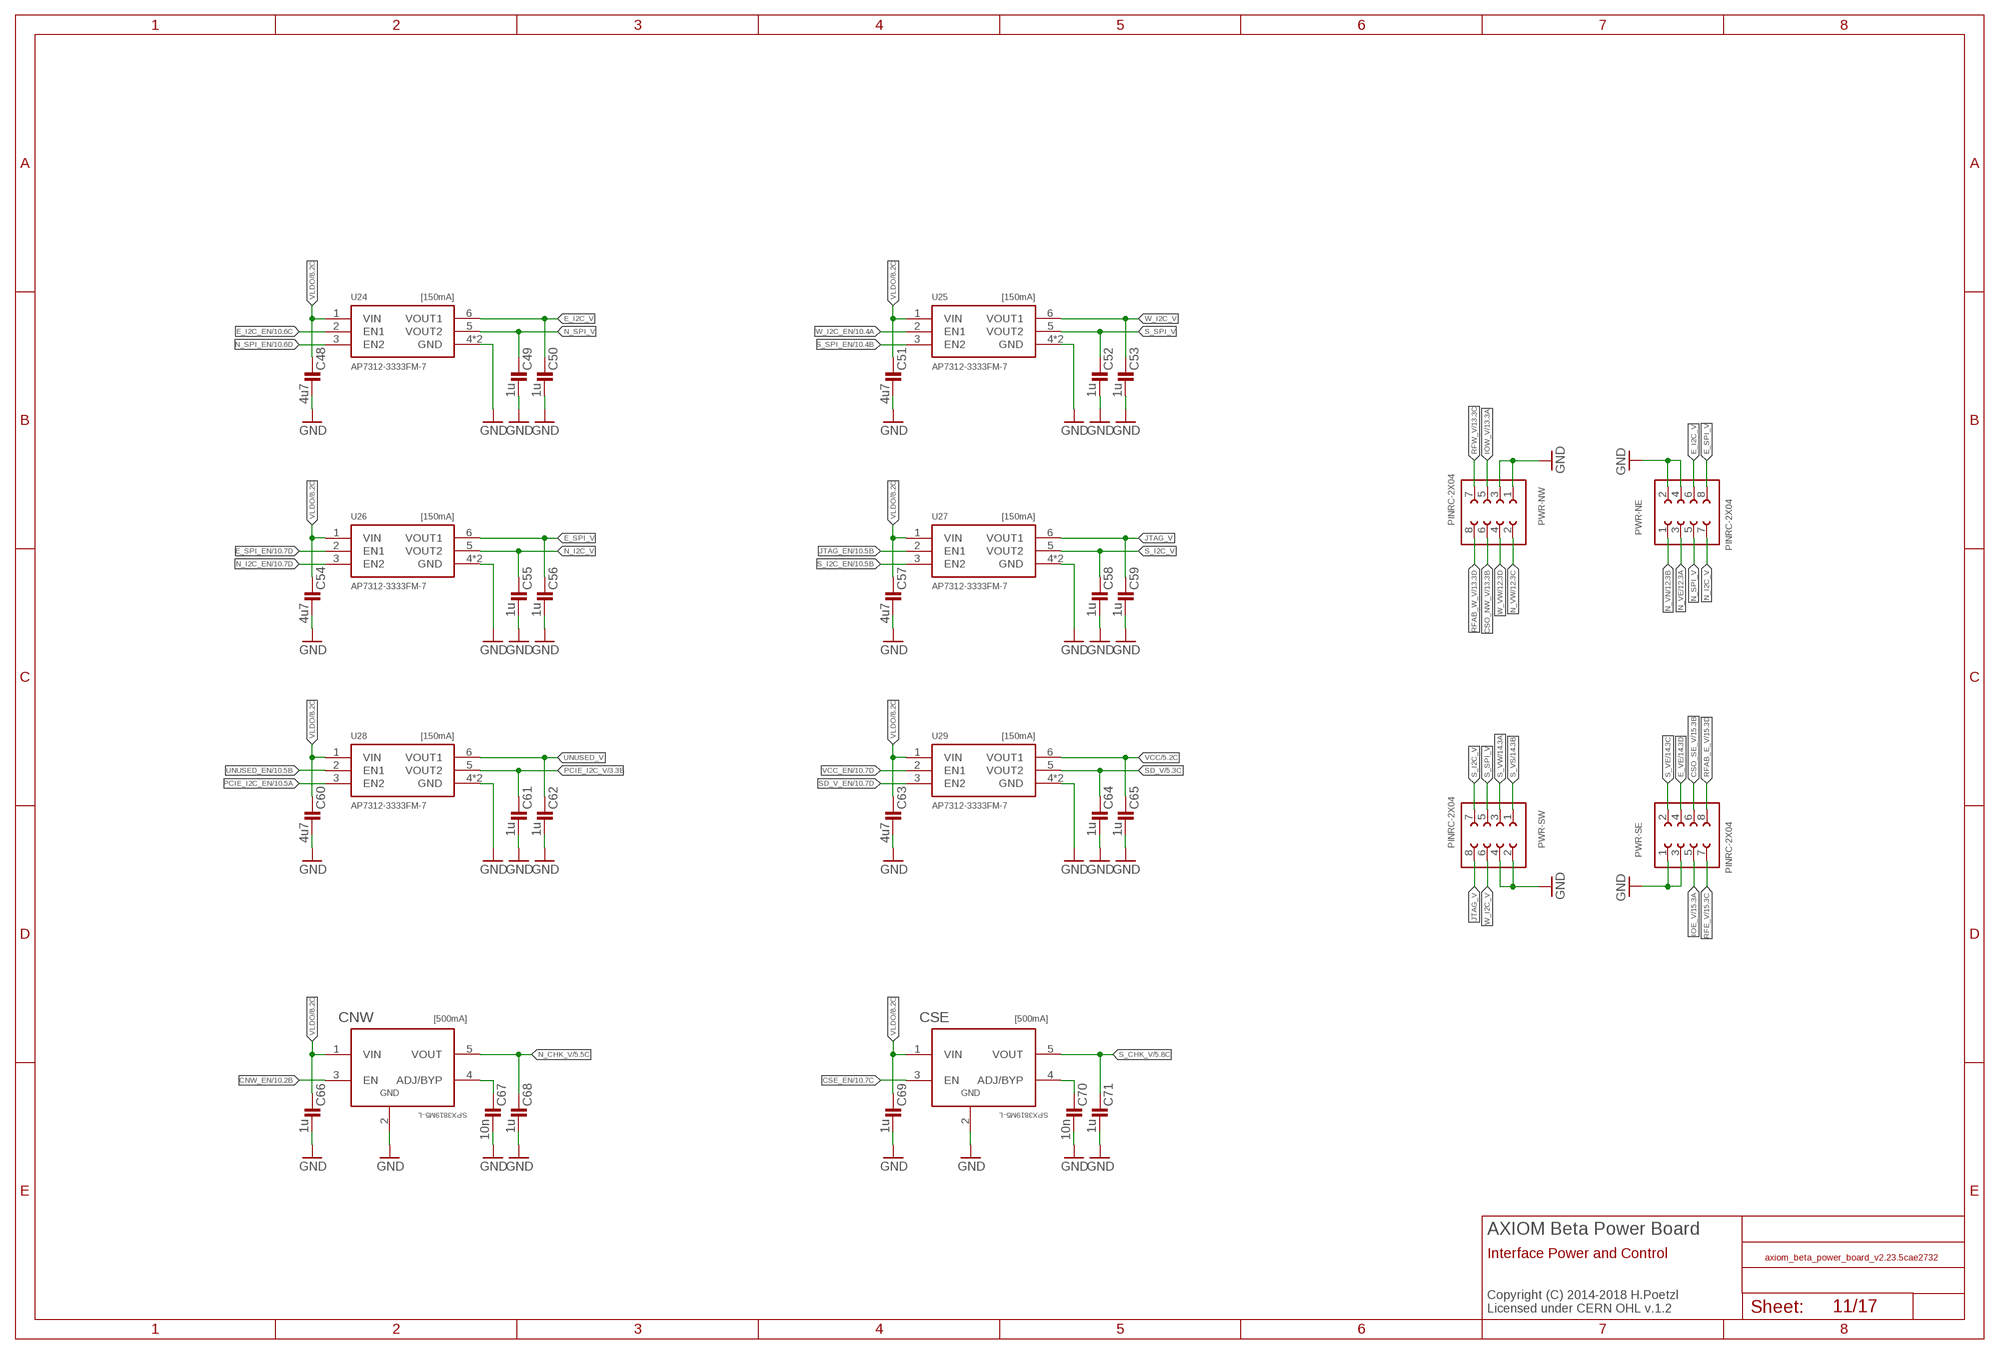
[diagram p11: schematic, sheet 11]

### Parts
C48  4u7  C0603-C  [0603-C]
C49  1u  C0402-C  [0402-C]
C50  1u  C0402-C  [0402-C]
C51  4u7  C0603-C  [0603-C]
C52  1u  C0402-C  [0402-C]
C53  1u  C0402-C  [0402-C]
C54  4u7  C0603-C  [0603-C]
C55  1u  C0402-C  [0402-C]
C56  1u  C0402-C  [0402-C]
C57  4u7  C0603-C  [0603-C]
C58  1u  C0402-C  [0402-C]
C59  1u  C0402-C  [0402-C]
C60  4u7  C0603-C  [0603-C]
C61  1u  C0402-C  [0402-C]
C62  1u  C0402-C  [0402-C]
C63  4u7  C0603-C  [0603-C]
C64  1u  C0402-C  [0402-C]
C65  1u  C0402-C  [0402-C]
C66  1u  C0402-B  [0402-B]
C67  10n  C0402-B  [0402-B]
C68  1u  C0402-B  [0402-B]
C69  1u  C0402-B  [0402-B]
C70  10n  C0402-B  [0402-B]
C71  1u  C0402-B  [0402-B]
CNW  SPX3819M5-L  [SOT95P280X145-5N]
CSE  SPX3819M5-L  [SOT95P280X145-5N]
PWR-NE  PINRC-2X04  [R2X04]  (not fitted in variant Beta)  (not fitted in variant Min)
PWR-NW  PINRC-2X04  [R2X04]  (not fitted in variant Beta)  (not fitted in variant Min)
PWR-SE  PINRC-2X04  [R2X04]  (not fitted in variant Beta)  (not fitted in variant Min)
PWR-SW  PINRC-2X04  [R2X04]  (not fitted in variant Beta)  (not fitted in variant Min)
U24  AP7312-3333FM-7  LDO_DUAL  [DFN2018-6]
U25  AP7312-3333FM-7  LDO_DUAL  [DFN2018-6]
U26  AP7312-3333FM-7  LDO_DUAL  [DFN2018-6]
U27  AP7312-3333FM-7  LDO_DUAL  [DFN2018-6]
U28  AP7312-3333FM-7  LDO_DUAL  [DFN2018-6]
U29  AP7312-3333FM-7  LDO_DUAL  [DFN2018-6]

### Nets
CNW_BYP: C67.1 CNW.4(ADJ/BYP)
CNW_EN: CNW.3(EN) ; also sheet 10
CSE_BYP: C70.1 CSE.4(ADJ/BYP)
CSE_EN: CSE.3(EN) ; also sheet 10
CSO_NW_V: PWR-NW.6 ; also sheet 10,13
CSO_SE_V: PWR-SE.6 ; also sheet 10,15
E_I2C_EN: U24.2(EN1) ; also sheet 10
E_I2C_V: C50.1 PWR-NE.6 U24.6(VOUT1)
E_SPI_EN: U26.2(EN1) ; also sheet 10
E_SPI_V: C56.1 PWR-NE.8 U26.6(VOUT1)
E_VE: PWR-SE.4 ; also sheet 10,14
GND: C48.2 C49.2 C50.2 C51.2 C52.2 C53.2 C54.2 C55.2 C56.2 C57.2 C58.2 C59.2 C60.2 C61.2 C62.2 C63.2 C64.2 C65.2 C66.2 C67.2 C68.2 C69.2 C70.2 C71.2 CNW.2(GND) CSE.2(GND) PWR-NE.2 PWR-NE.4 PWR-NW.1 PWR-NW.3 PWR-SE.1 PWR-SE.3 PWR-SW.2 PWR-SW.4 U24.4(GND) U24.10(GND) U25.4(GND) U25.10(GND) U26.4(GND) U26.10(GND) U27.4(GND) U27.10(GND) U28.4(GND) U28.10(GND) U29.4(GND) U29.10(GND) ; also sheet 2,3,5,6,7,8,9,10,12,13,14,15,16,17
IOE_V: PWR-SE.5 ; also sheet 5,10,15
IOW_V: PWR-NW.5 ; also sheet 5,10,13
JTAG_EN: U27.2(EN1) ; also sheet 10
JTAG_V: C59.1 PWR-SW.8 U27.6(VOUT1)
N_CHK_V: C68.1 CNW.5(VOUT) ; also sheet 5
N_I2C_EN: U26.3(EN2) ; also sheet 10
N_I2C_V: C55.1 PWR-NE.7 U26.5(VOUT2)
N_SPI_EN: U24.3(EN2) ; also sheet 10
N_SPI_V: C49.1 PWR-NE.5 U24.5(VOUT2)
N_VE: PWR-NE.3 ; also sheet 12
N_VN: PWR-NE.1 ; also sheet 12
N_VW: PWR-NW.2 ; also sheet 12
PCIE_I2C_EN: U28.3(EN2) ; also sheet 10
PCIE_I2C_V: C61.1 U28.5(VOUT2) ; also sheet 3
RFAB_E_V: PWR-SE.8 ; also sheet 10,15
RFAB_W_V: PWR-NW.8 ; also sheet 10,13
RFE_V: PWR-SE.7 ; also sheet 10,15
RFW_V: PWR-NW.7 ; also sheet 10,13
S_CHK_V: C71.1 CSE.5(VOUT) ; also sheet 5
S_I2C_EN: U27.3(EN2) ; also sheet 10
S_I2C_V: C58.1 PWR-SW.7 U27.5(VOUT2)
S_SPI_EN: U25.3(EN2) ; also sheet 10
S_SPI_V: C52.1 PWR-SW.5 U25.5(VOUT2)
S_VE: PWR-SE.2 ; also sheet 14
S_VS: PWR-SW.1 ; also sheet 14
S_VW: PWR-SW.3 ; also sheet 14
SD_V: C64.1 U29.5(VOUT2) ; also sheet 5,8
SD_V_EN: U29.3(EN2) ; also sheet 10
UNUSED_EN: U28.2(EN1) ; also sheet 10
UNUSED_V: C62.1 U28.6(VOUT1)
VCC: C65.1 U29.6(VOUT1) ; also sheet 5,9
VCC_EN: U29.2(EN1) ; also sheet 10
VLDO: C48.1 C51.1 C54.1 C57.1 C60.1 C63.1 C66.1 C69.1 CNW.1(VIN) CSE.1(VIN) U24.1(VIN) U25.1(VIN) U26.1(VIN) U27.1(VIN) U28.1(VIN) U29.1(VIN) ; also sheet 8,10
W_I2C_EN: U25.2(EN1) ; also sheet 10
W_I2C_V: C53.1 PWR-SW.6 U25.6(VOUT1)
W_VW: PWR-NW.4 ; also sheet 10,12

### Notes on the sheet
- [150mA] | [150mA]
- [150mA] | [150mA]
- [150mA] | [150mA]
- [500mA] | [500mA]
- AXIOM Beta Power Board
- Interface Power and Control
- Copyright (C) 2014-2018 H.Poetzl
  Licensed under CERN OHL v.1.2

## Sheet 12 of 17
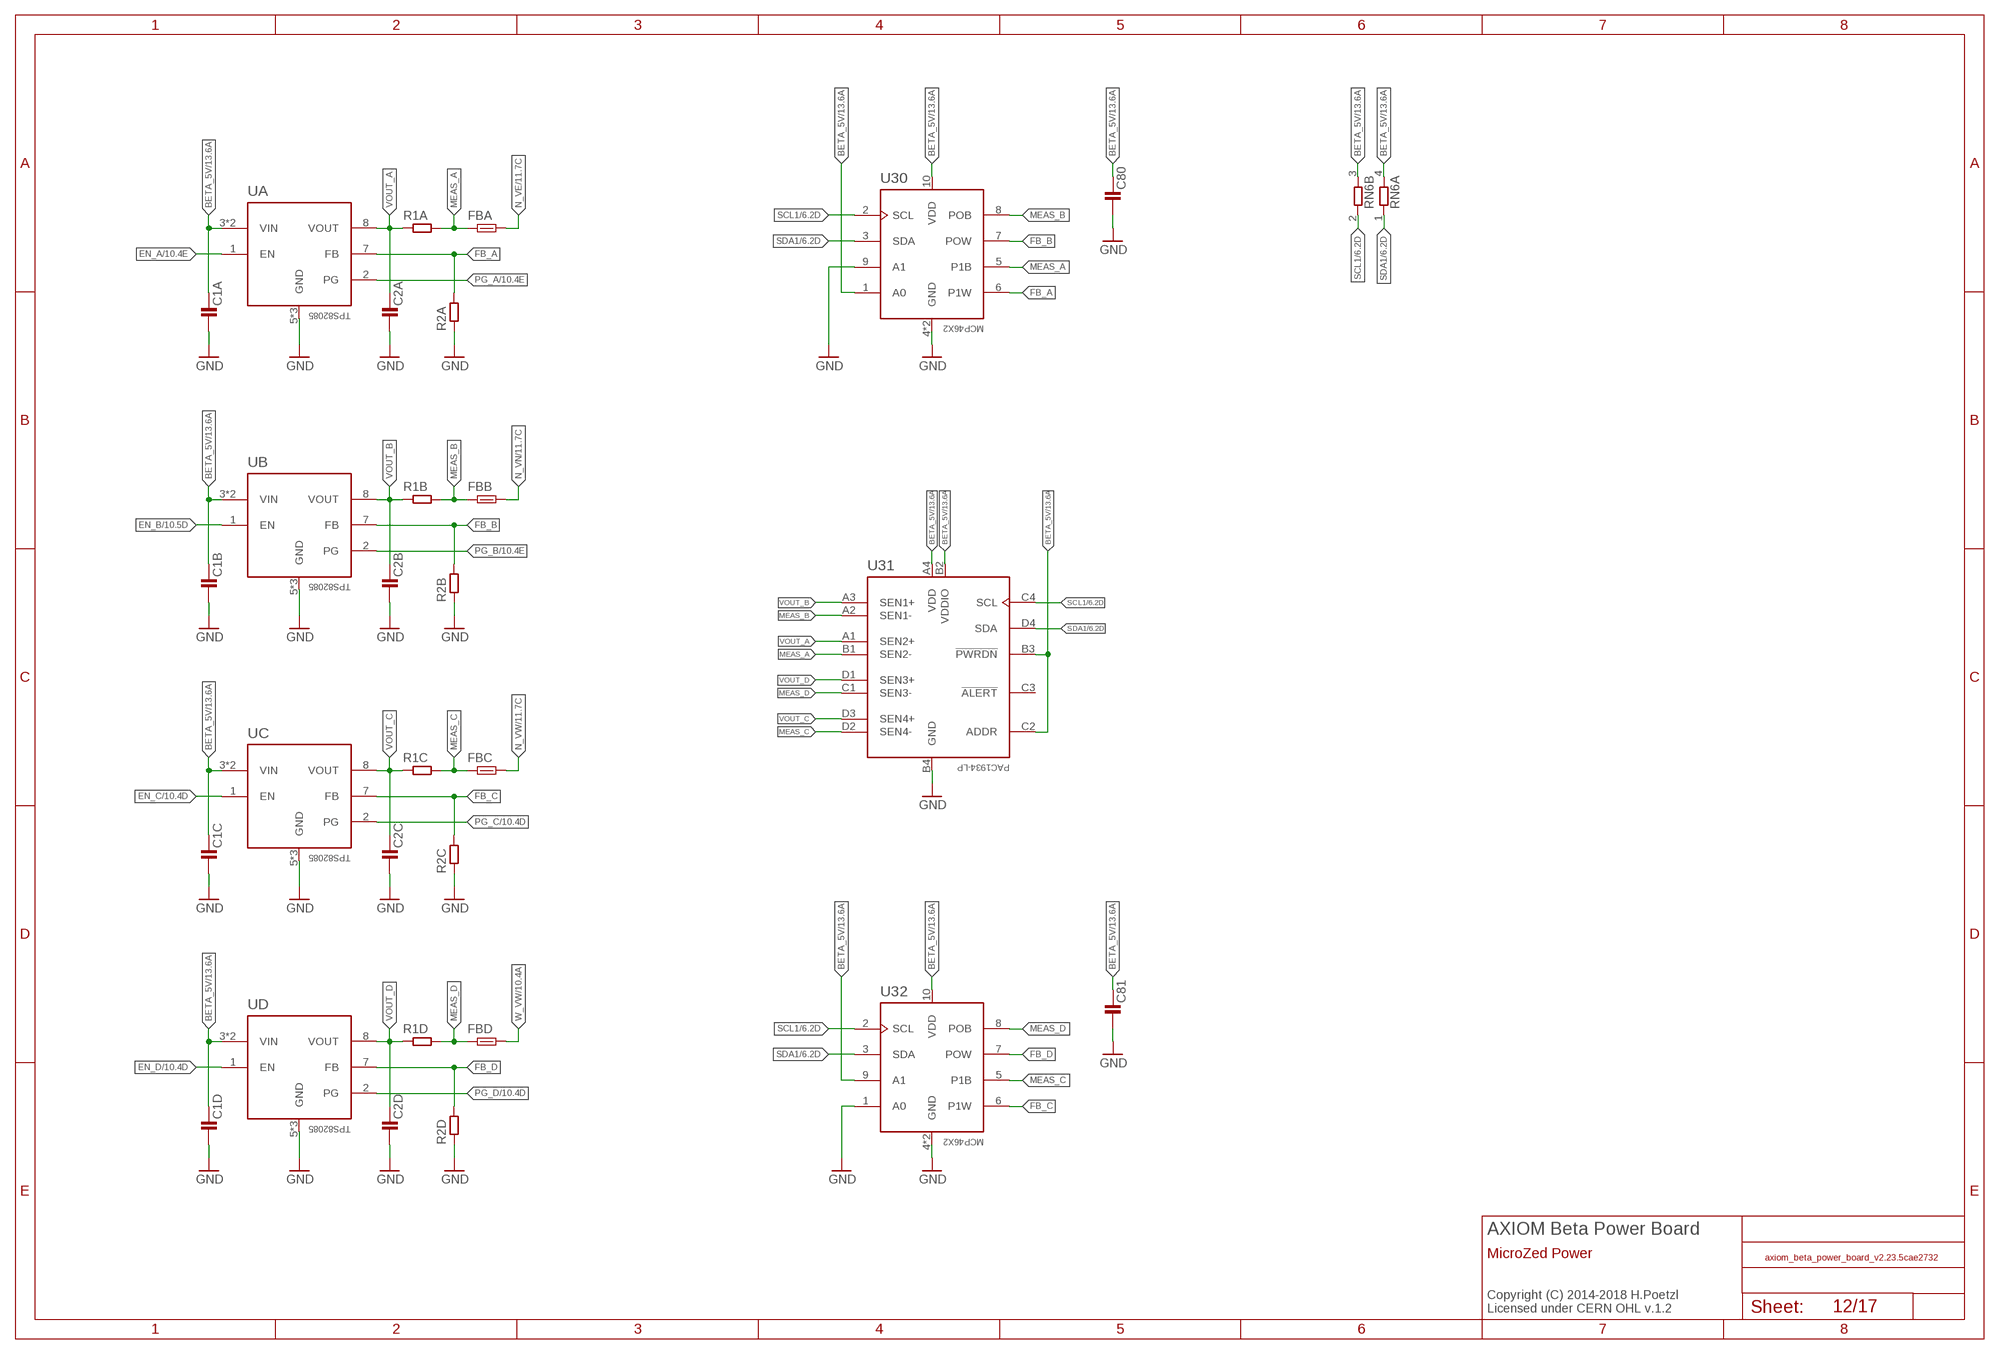
[diagram p12: schematic, sheet 12]

### Parts
C1A  C0603-C  [0603-C]
C1B  C0603-C  [0603-C]
C1C  C0603-C  [0603-C]
C1D  C0603-C  [0603-C]
C2A  C0603-C  [0603-C]
C2B  C0603-C  [0603-C]
C2C  C0603-C  [0603-C]
C2D  C0603-C  [0603-C]
C80  C0402-C  [0402-C]
C81  C0402-C  [0402-C]
FBA  FB0603-C  [0603-C]
FBB  FB0603-C  [0603-C]
FBC  FB0603-C  [0603-C]
FBD  FB0603-C  [0603-C]
R1A  R0603-C  [0603-C]
R1B  R0603-C  [0603-C]
R1C  R0603-C  [0603-C]
R1D  R0603-C  [0603-C]
R2A  R0402-C  [0402-C]
R2B  R0402-C  [0402-C]
R2C  R0402-C  [0402-C]
R2D  R0402-C  [0402-C]
RN6  2R-NEXB24V  [EXB24V]
U30  MCP46X2  [DFN-10]
U31  PAC1934-LP  [WLCSP-16-LP]
U32  MCP46X2  [DFN-10]
UA  TPS82085  [MICROSIP]
UB  TPS82085  [MICROSIP]
UC  TPS82085  [MICROSIP]
UD  TPS82085  [MICROSIP]

### Nets
BETA_5V: C1A.1 C1B.1 C1C.1 C1D.1 C80.1 C81.1 RN6.3 RN6.4 U30.1(A0) U30.10(VDD) U31.A4(VDD) U31.B2(VDDIO) U31.B3(!PWRDN) U31.C2(ADDR) U32.9(A1) U32.10(VDD) UA.3(VIN) UA.4(VIN) UB.3(VIN) UB.4(VIN) UC.3(VIN) UC.4(VIN) UD.3(VIN) UD.4(VIN) ; also sheet 6,7,8,13,14,15,16,17
EN_A: UA.1(EN) ; also sheet 10
EN_B: UB.1(EN) ; also sheet 10
EN_C: UC.1(EN) ; also sheet 10
EN_D: UD.1(EN) ; also sheet 10
FB_A: R2A.2 U30.6(P1W) UA.7(FB)
FB_B: R2B.2 U30.7(POW) UB.7(FB)
FB_C: R2C.2 U32.6(P1W) UC.7(FB)
FB_D: R2D.2 U32.7(POW) UD.7(FB)
GND: C1A.2 C1B.2 C1C.2 C1D.2 C2A.2 C2B.2 C2C.2 C2D.2 C80.2 C81.2 R2A.1 R2B.1 R2C.1 R2D.1 U30.4(GND) U30.9(A1) U30.EP(GND) U31.B4(GND) U32.1(A0) U32.4(GND) U32.EP(GND) UA.5(GND) UA.6(GND) UA.EP(GND) UB.5(GND) UB.6(GND) UB.EP(GND) UC.5(GND) UC.6(GND) UC.EP(GND) UD.5(GND) UD.6(GND) UD.EP(GND) ; also sheet 2,3,5,6,7,8,9,10,11,13,14,15,16,17
MEAS_A: FBA.1 R1A.2 U30.5(P1B) U31.B1(SEN2-)
MEAS_B: FBB.1 R1B.2 U30.8(POB) U31.A2(SEN1-)
MEAS_C: FBC.1 R1C.2 U31.D2(SEN4-) U32.5(P1B)
MEAS_D: FBD.1 R1D.2 U31.C1(SEN3-) U32.8(POB)
N_VE: FBA.2 ; also sheet 11
N_VN: FBB.2 ; also sheet 11
N_VW: FBC.2 ; also sheet 11
PG_A: UA.2(PG) ; also sheet 10
PG_B: UB.2(PG) ; also sheet 10
PG_C: UC.2(PG) ; also sheet 10
PG_D: UD.2(PG) ; also sheet 10
SCL1: RN6.2 U30.2(SCL) U31.C4(SCL) U32.2(SCL) ; also sheet 6,10
SDA1: RN6.1 U30.3(SDA) U31.D4(SDA) U32.3(SDA) ; also sheet 6,10
VOUT_A: C2A.1 R1A.1 U31.A1(SEN2+) UA.8(VOUT)
VOUT_B: C2B.1 R1B.1 U31.A3(SEN1+) UB.8(VOUT)
VOUT_C: C2C.1 R1C.1 U31.D3(SEN4+) UC.8(VOUT)
VOUT_D: C2D.1 R1D.1 U31.D1(SEN3+) UD.8(VOUT)
W_VW: FBD.2 ; also sheet 10,11
Unconnected: U31.C3(!ALERT)

### Notes on the sheet
- AXIOM Beta Power Board
- MicroZed Power
- Copyright (C) 2014-2018 H.Poetzl
  Licensed under CERN OHL v.1.2

## Sheet 13 of 17
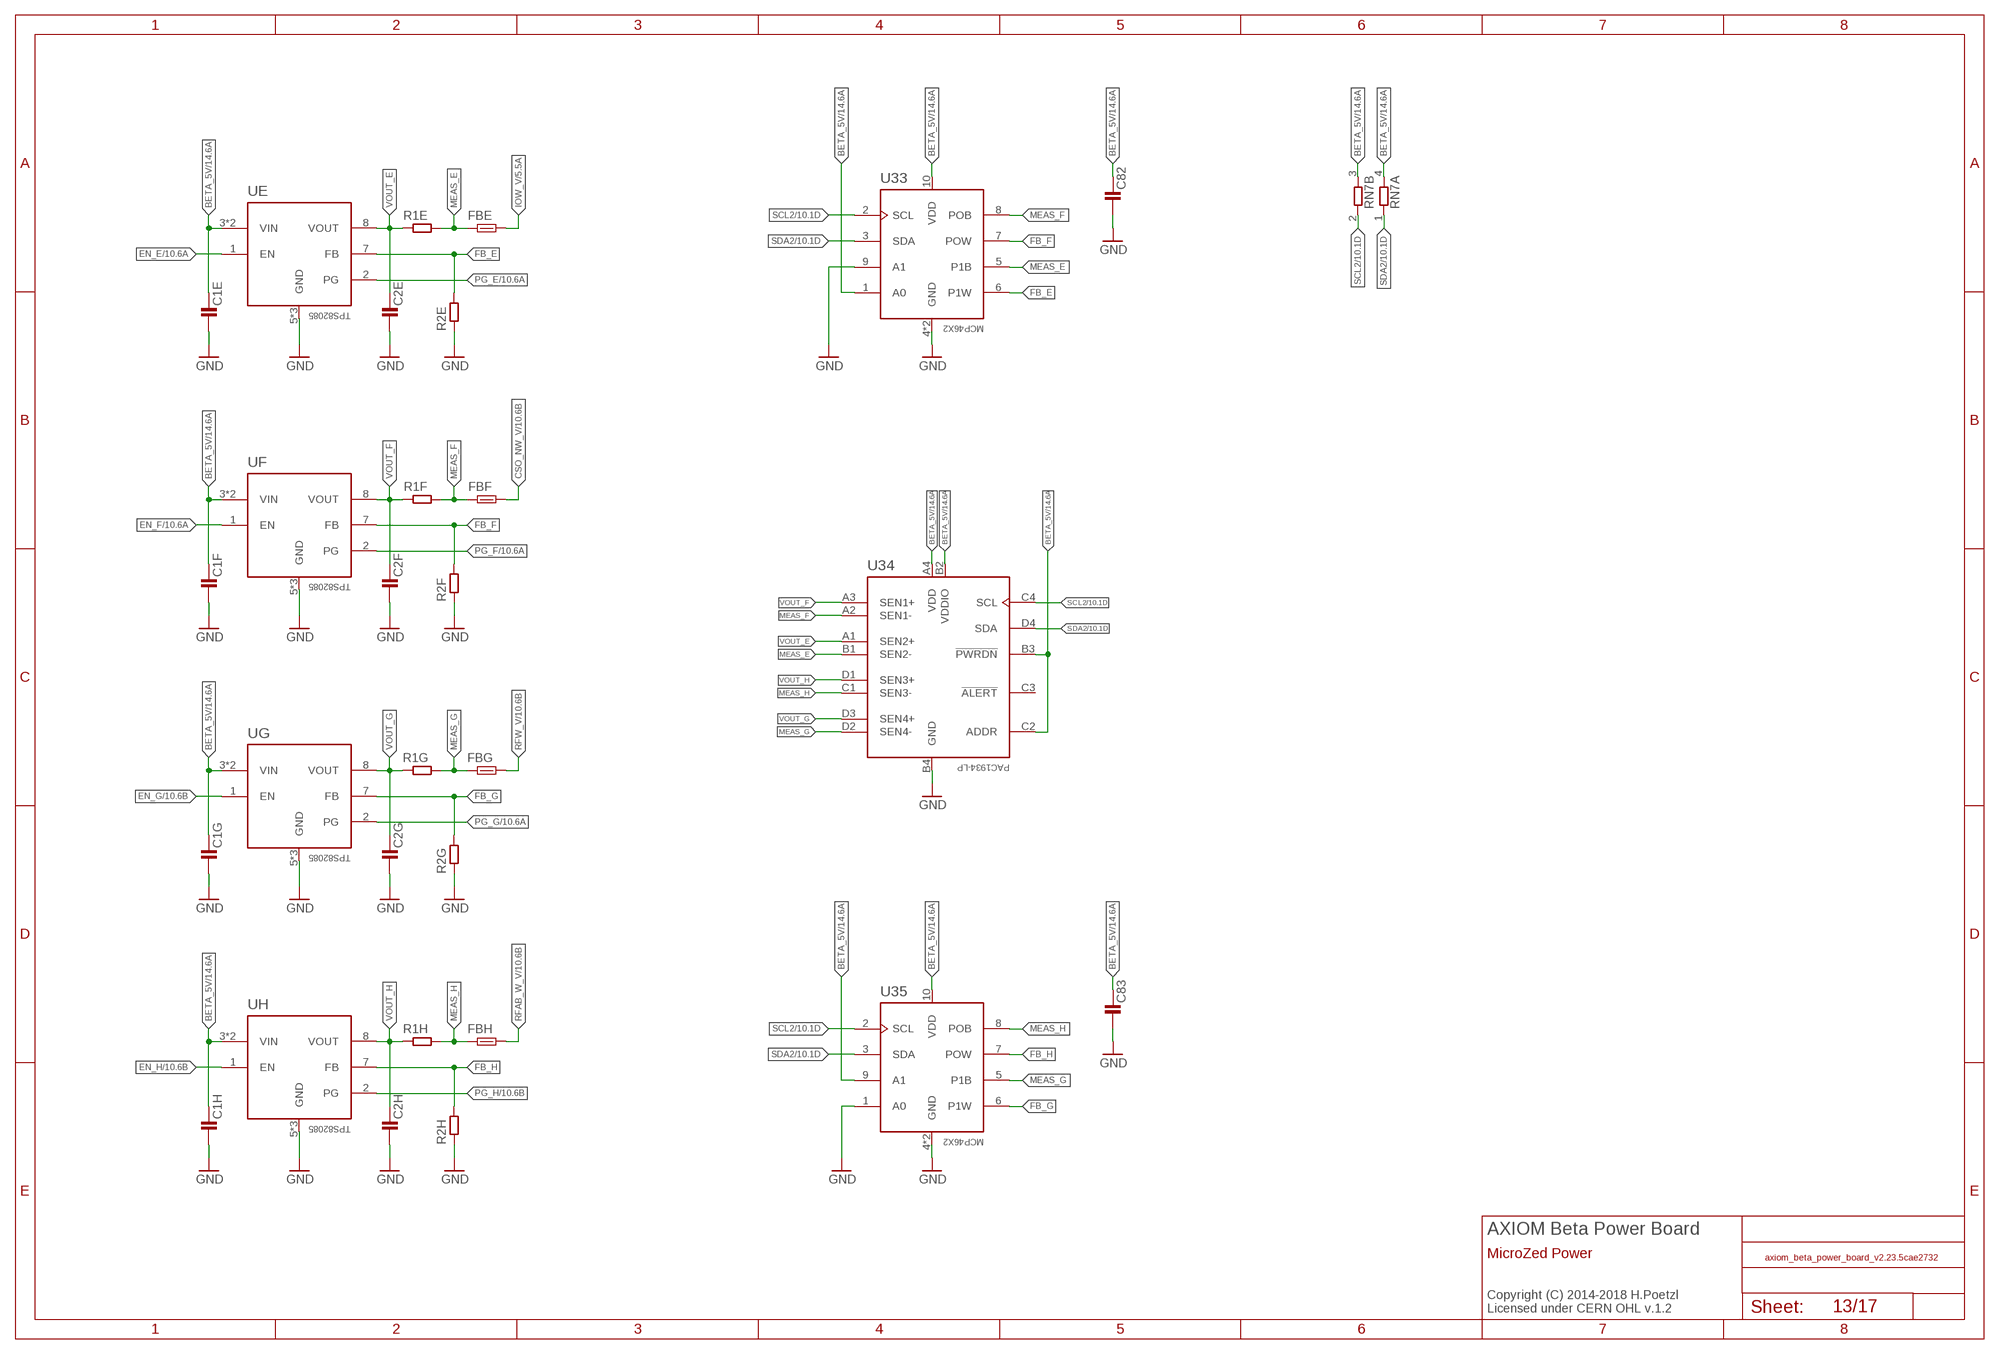
[diagram p13: schematic, sheet 13]

### Parts
C1E  C0603-C  [0603-C]
C1F  C0603-C  [0603-C]
C1G  C0603-C  [0603-C]
C1H  C0603-C  [0603-C]
C2E  C0603-C  [0603-C]
C2F  C0603-C  [0603-C]
C2G  C0603-C  [0603-C]
C2H  C0603-C  [0603-C]
C82  C0402-C  [0402-C]
C83  C0402-C  [0402-C]
FBE  FB0603-C  [0603-C]
FBF  FB0603-C  [0603-C]
FBG  FB0603-C  [0603-C]
FBH  FB0603-C  [0603-C]
R1E  R0603-C  [0603-C]
R1F  R0603-C  [0603-C]
R1G  R0603-C  [0603-C]
R1H  R0603-C  [0603-C]
R2E  R0402-C  [0402-C]
R2F  R0402-C  [0402-C]
R2G  R0402-C  [0402-C]
R2H  R0402-C  [0402-C]
RN7  2R-NEXB24V  [EXB24V]
U33  MCP46X2  [DFN-10]
U34  PAC1934-LP  [WLCSP-16-LP]
U35  MCP46X2  [DFN-10]
UE  TPS82085  [MICROSIP]
UF  TPS82085  [MICROSIP]
UG  TPS82085  [MICROSIP]
UH  TPS82085  [MICROSIP]

### Nets
BETA_5V: C1E.1 C1F.1 C1G.1 C1H.1 C82.1 C83.1 RN7.3 RN7.4 U33.1(A0) U33.10(VDD) U34.A4(VDD) U34.B2(VDDIO) U34.B3(!PWRDN) U34.C2(ADDR) U35.9(A1) U35.10(VDD) UE.3(VIN) UE.4(VIN) UF.3(VIN) UF.4(VIN) UG.3(VIN) UG.4(VIN) UH.3(VIN) UH.4(VIN) ; also sheet 6,7,8,12,14,15,16,17
CSO_NW_V: FBF.2 ; also sheet 10,11
EN_E: UE.1(EN) ; also sheet 10
EN_F: UF.1(EN) ; also sheet 10
EN_G: UG.1(EN) ; also sheet 10
EN_H: UH.1(EN) ; also sheet 10
FB_E: R2E.2 U33.6(P1W) UE.7(FB)
FB_F: R2F.2 U33.7(POW) UF.7(FB)
FB_G: R2G.2 U35.6(P1W) UG.7(FB)
FB_H: R2H.2 U35.7(POW) UH.7(FB)
GND: C1E.2 C1F.2 C1G.2 C1H.2 C2E.2 C2F.2 C2G.2 C2H.2 C82.2 C83.2 R2E.1 R2F.1 R2G.1 R2H.1 U33.4(GND) U33.9(A1) U33.EP(GND) U34.B4(GND) U35.1(A0) U35.4(GND) U35.EP(GND) UE.5(GND) UE.6(GND) UE.EP(GND) UF.5(GND) UF.6(GND) UF.EP(GND) UG.5(GND) UG.6(GND) UG.EP(GND) UH.5(GND) UH.6(GND) UH.EP(GND) ; also sheet 2,3,5,6,7,8,9,10,11,12,14,15,16,17
IOW_V: FBE.2 ; also sheet 5,10,11
MEAS_E: FBE.1 R1E.2 U33.5(P1B) U34.B1(SEN2-)
MEAS_F: FBF.1 R1F.2 U33.8(POB) U34.A2(SEN1-)
MEAS_G: FBG.1 R1G.2 U34.D2(SEN4-) U35.5(P1B)
MEAS_H: FBH.1 R1H.2 U34.C1(SEN3-) U35.8(POB)
PG_E: UE.2(PG) ; also sheet 10
PG_F: UF.2(PG) ; also sheet 10
PG_G: UG.2(PG) ; also sheet 10
PG_H: UH.2(PG) ; also sheet 10
RFAB_W_V: FBH.2 ; also sheet 10,11
RFW_V: FBG.2 ; also sheet 10,11
SCL2: RN7.2 U33.2(SCL) U34.C4(SCL) U35.2(SCL) ; also sheet 10
SDA2: RN7.1 U33.3(SDA) U34.D4(SDA) U35.3(SDA) ; also sheet 10
VOUT_E: C2E.1 R1E.1 U34.A1(SEN2+) UE.8(VOUT)
VOUT_F: C2F.1 R1F.1 U34.A3(SEN1+) UF.8(VOUT)
VOUT_G: C2G.1 R1G.1 U34.D3(SEN4+) UG.8(VOUT)
VOUT_H: C2H.1 R1H.1 U34.D1(SEN3+) UH.8(VOUT)
Unconnected: U34.C3(!ALERT)

### Notes on the sheet
- AXIOM Beta Power Board
- MicroZed Power
- Copyright (C) 2014-2018 H.Poetzl
  Licensed under CERN OHL v.1.2